# EAGLE board microBoard_power (EAGLE 6.2), part 1 of 2
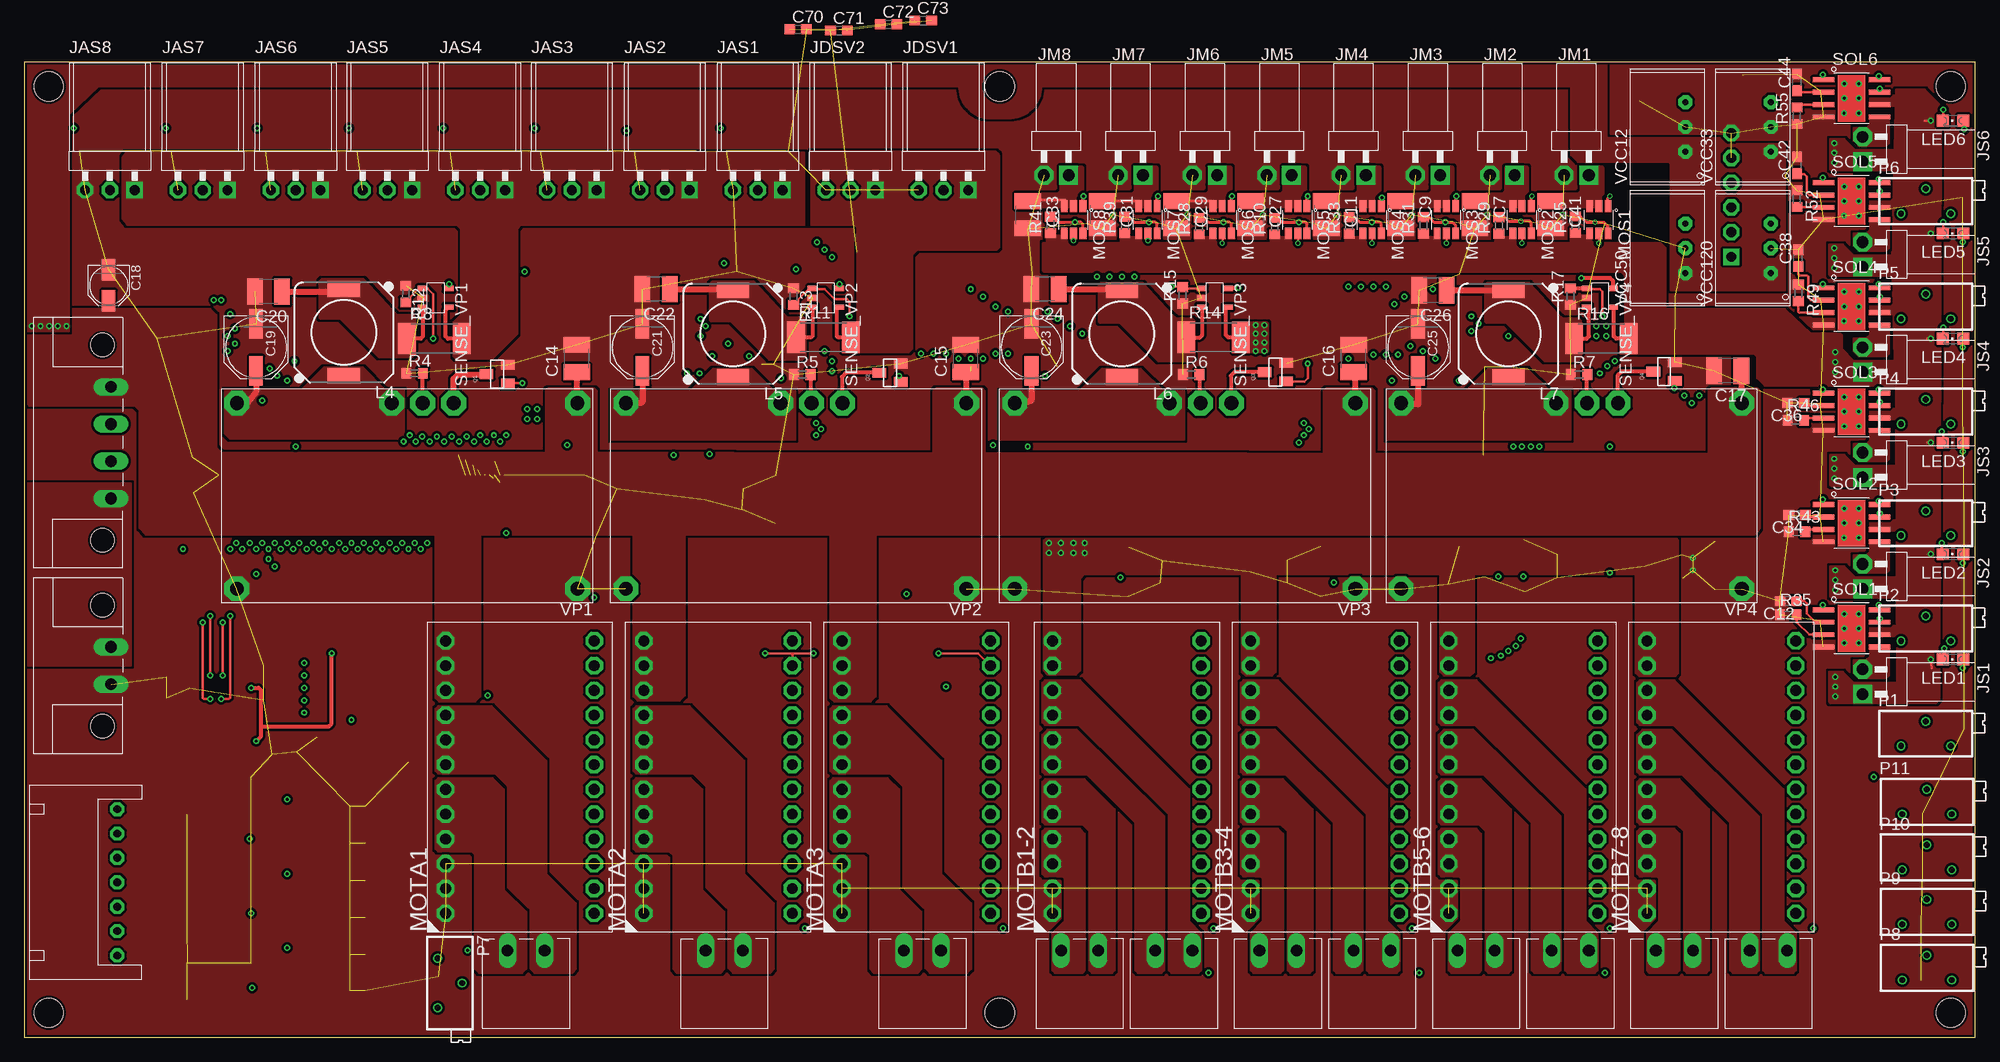
[diagram p8: board, top side]
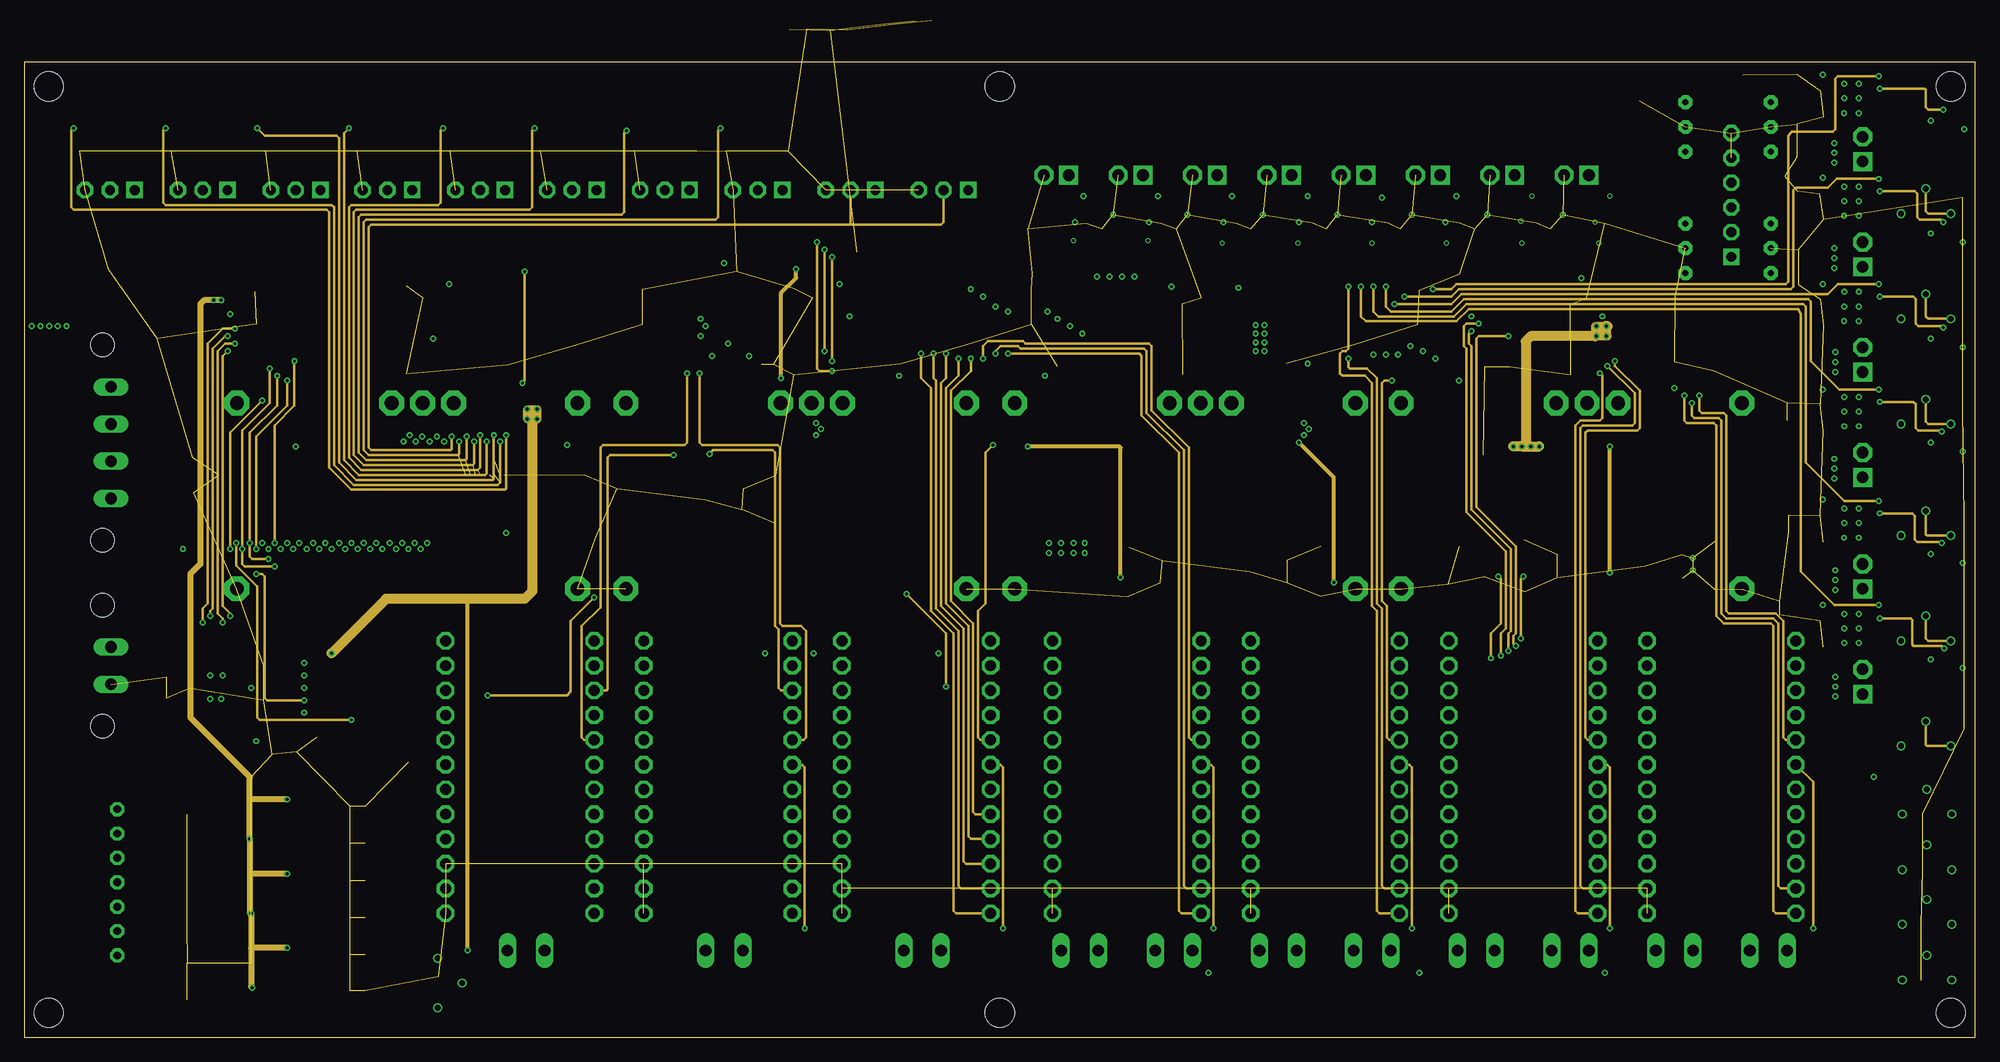
[diagram p9: board, inner layer Route2]
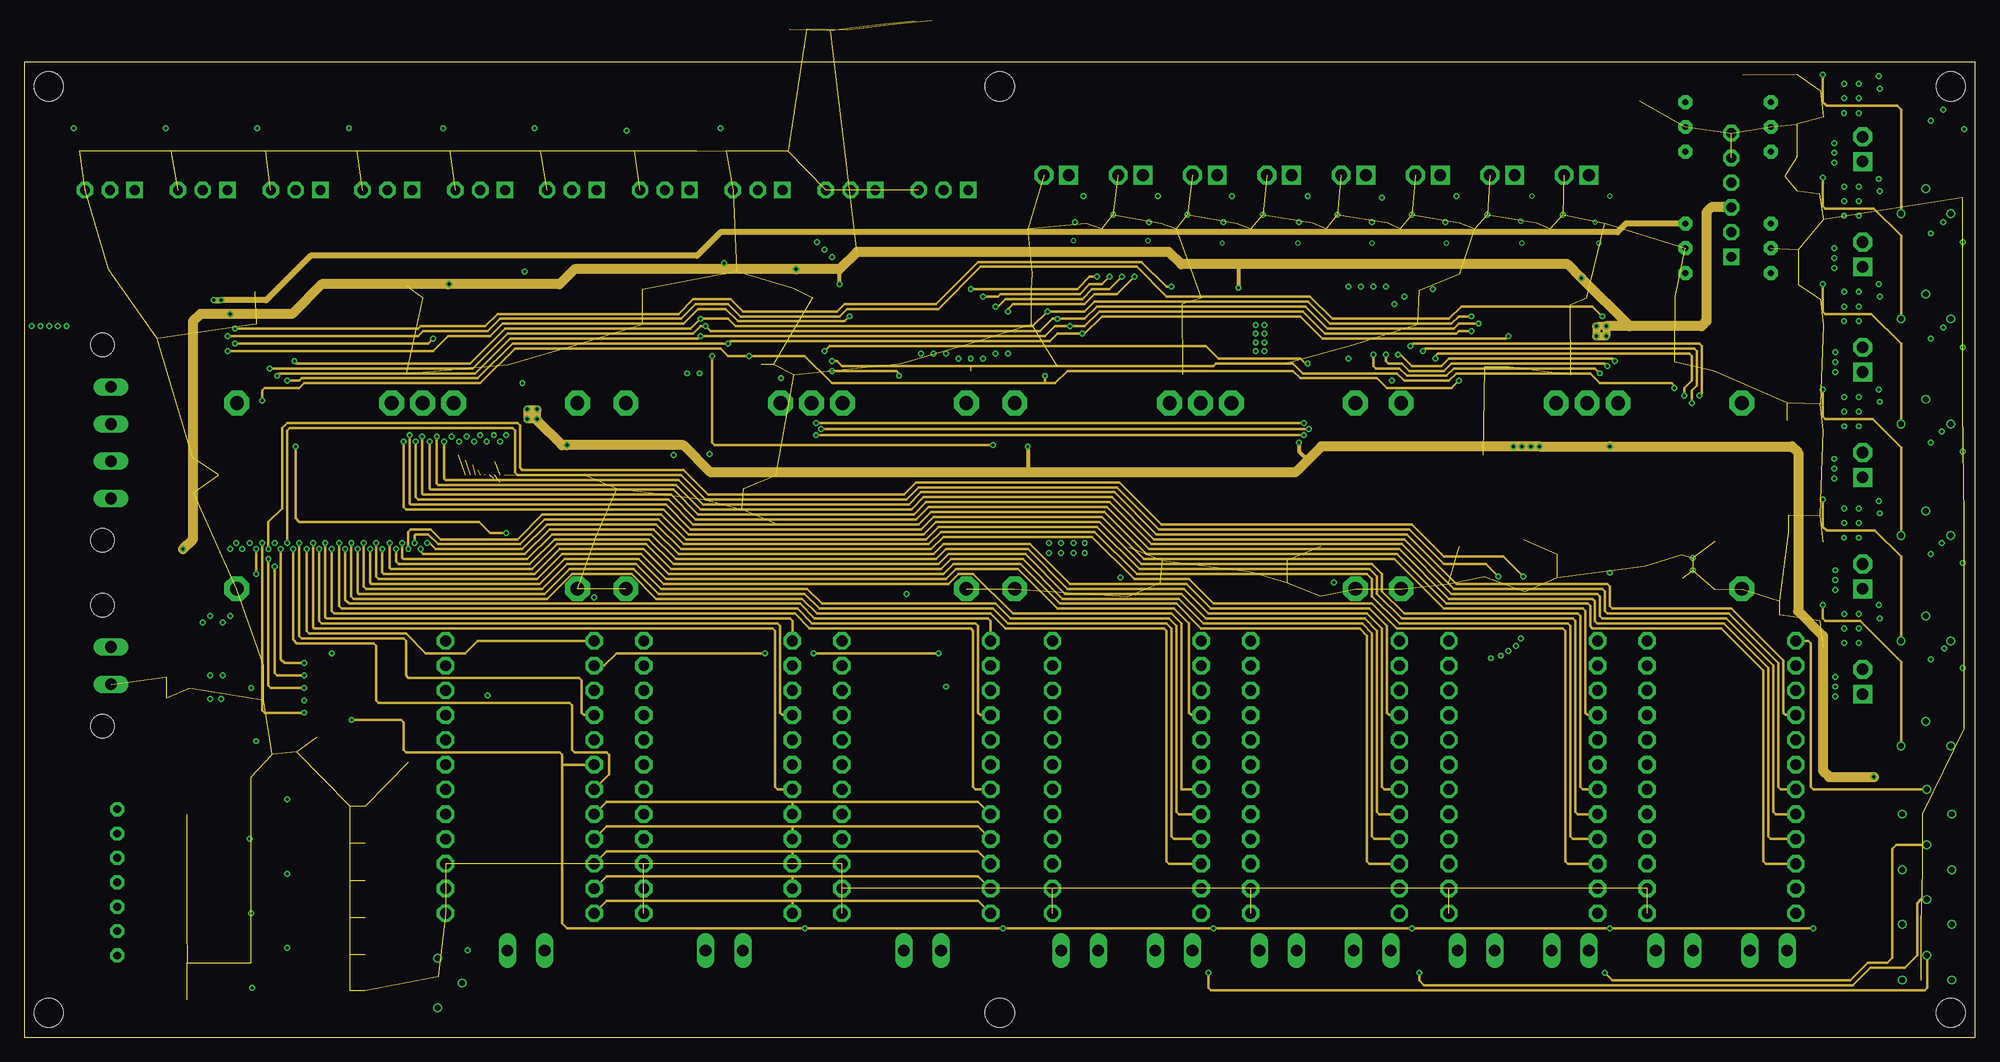
[diagram p10: board, inner layer Route15]
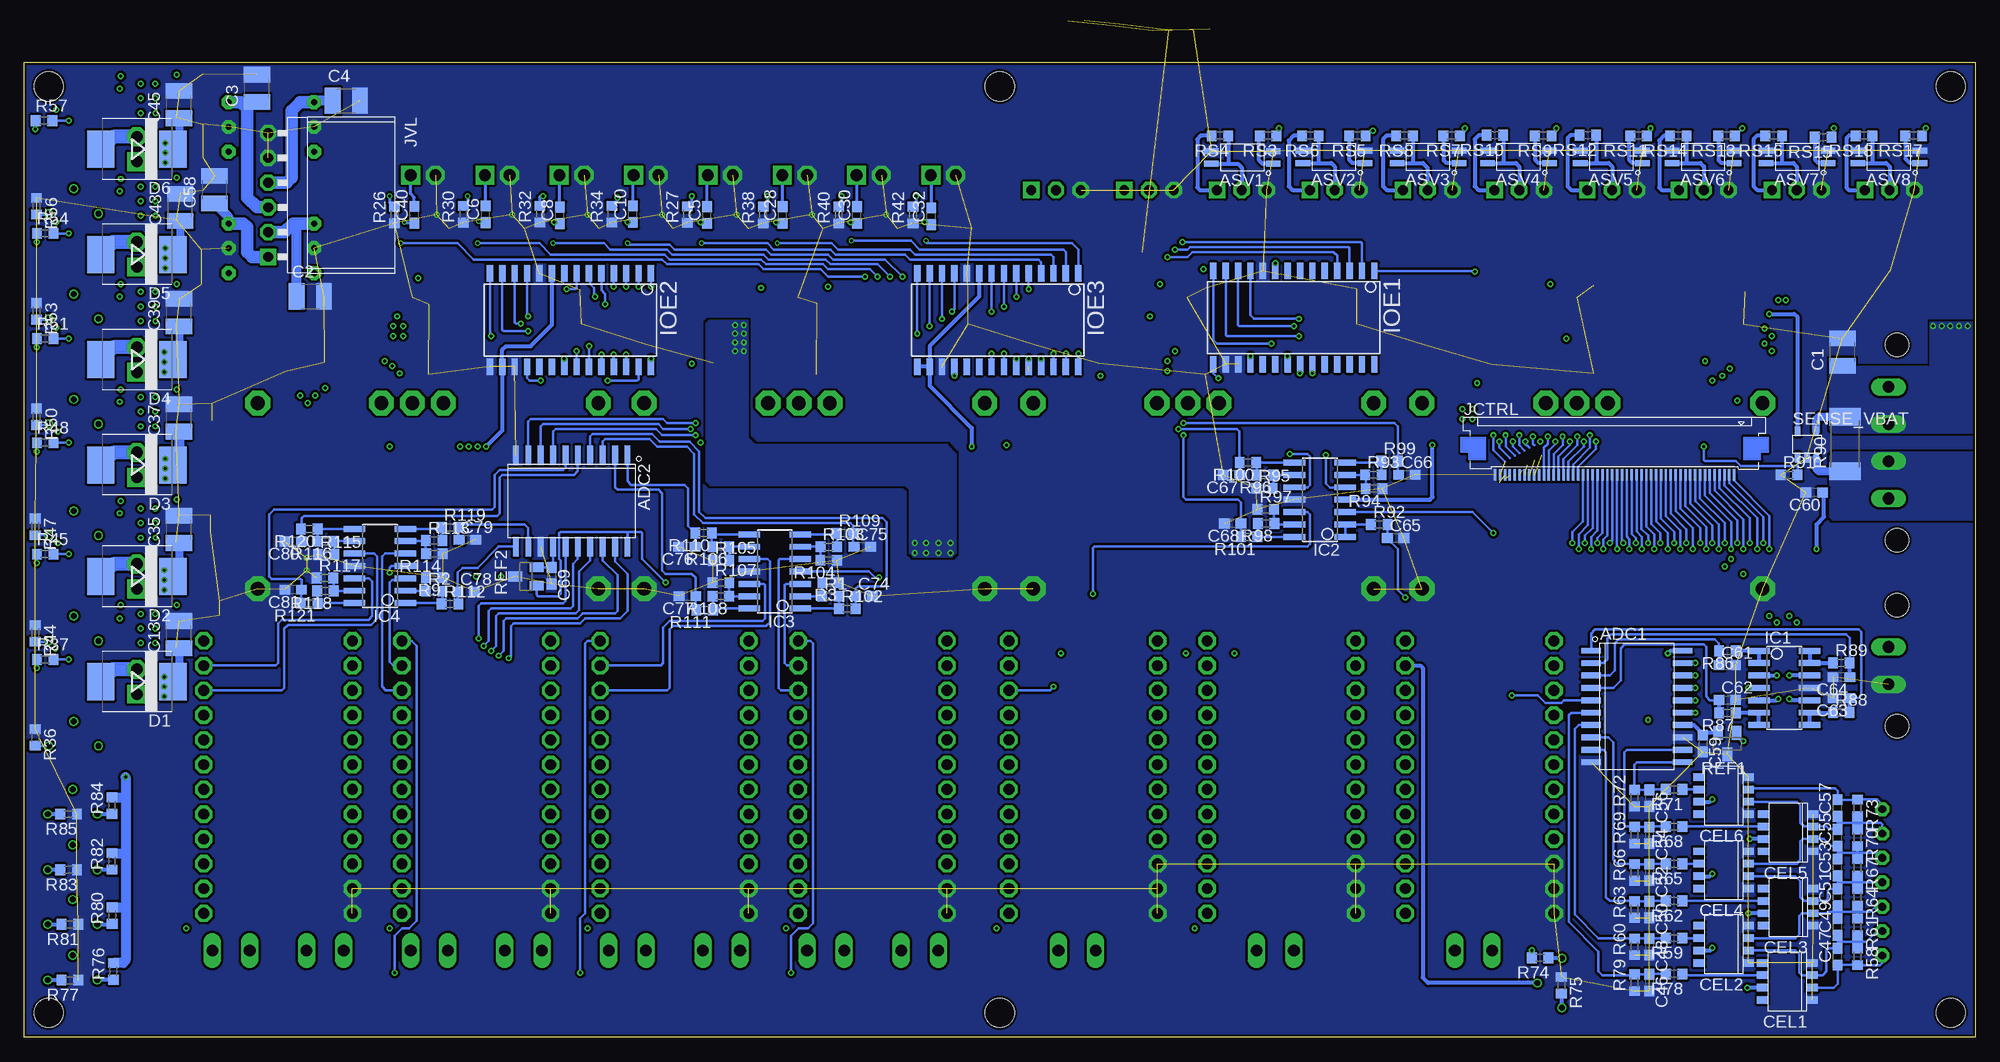
[diagram p11: board, bottom side, seen from below]

Size 200 x 100 mm. Coordinates in mm from the lower left corner, seen from the top.
Outline: 0,0 200,0 200,100 0,100 0,0
Copper layers (1*2*15*16): Top 0.035mm / dielectric 0.2mm / Route2 0.0175mm / dielectric 0.3mm / Route15 0.0175mm / dielectric 0.2mm / Bottom 0.035mm
Design rules: minimum track width 8mil, minimum drill 0.3mm, track to track 8mil, track to pad 8mil, pad to pad 8mil, via to via 8mil, smd to smd 0mil, copper to edge 10mil, drill to drill 8mil, minimum pad ring 6mil, minimum via ring 4mil, stop-mask expansion 4mil, vias tented up to drill 100mil, thermal gap 10mil
Holes 3 mm at 197.5,2.5 2.5,2.5 2.5,97.5 197.5,97.5 100,2.5 100,97.5

## Footprints (pad centres in the part's own frame; a part is rotated, then mirrored left to right if it is on the bottom)
SSOP_20 = smd 0.6 x 2: 1 -5.715,-4.7; 2 -4.445,-4.7; 3 -3.175,-4.7; 4 -1.905,-4.7; 5 -0.635,-4.7; 6 0.635,-4.7; 7 1.905,-4.7; 8 3.175,-4.7; 9 4.445,-4.7; 10 5.715,-4.7; 11 5.715,4.7; 12 4.445,4.7; 13 3.175,4.7; 14 1.905,4.7; 15 0.635,4.7; 16 -0.635,4.7; 17 -1.905,4.7; 18 -3.175,4.7; 19 -4.445,4.7; 20 -5.715,4.7
SSOP_4 = smd 1.5 x 0.6: 1 -3.175,0.635; 2 -3.175,-0.635; 3 3.175,-0.635; 4 3.175,0.635
C3225 = smd 1.6 x 2.7: 1 -1.4,0; 2 1.4,0
C1210 = smd 1.6 x 2.7: 1 -1.4,0; 2 1.4,0
C0603 = smd 1.1 x 1: 1 -0.85,0; 2 0.85,0
PANASONIC_B = smd 2.2 x 1.4: + 1.6,0; - -1.6,0
PANASONIC_D = smd 3 x 1.4: + 2.4,0; - -2.4,0
S8 = smd 0.762 x 1.143: 1 -1.905,-2.54; 2 -0.635,-2.54; 3 0.635,-2.54; 4 1.905,-2.54; 5 1.905,2.54; 6 0.635,2.54; 7 -0.635,2.54; 8 -1.905,2.54
SMC = smd 2.8 x 3.8: A 3.7,0; C -3.7,0
SO14 = smd 0.61 x 2.21: 1 -3.81,-2.603; 2 -2.54,-2.603; 3 -1.27,-2.603; 4 0,-2.603; 5 1.27,-2.603; 6 2.54,-2.603; 7 3.81,-2.603; 8 3.81,2.603; 9 2.54,2.603; 10 1.27,2.603; 11 0,2.603; 12 -1.27,2.603; 13 -2.54,2.603; 14 -3.81,2.603
SO28W = smd 0.65 x 1.7: 1 -7.62,-4.78; 2 -6.35,-4.78; 3 -5.08,-4.78; 4 -3.81,-4.78; 5 -2.54,-4.78; 6 -1.27,-4.78; 7 0,-4.78; 8 1.27,-4.78; 9 2.54,-4.78; 10 3.81,-4.78; 11 5.08,-4.78; 12 6.35,-4.78; 13 7.62,-4.78; 14 8.89,-4.78; 15 8.89,4.78; 16 7.62,4.78; 17 6.35,4.78; 18 5.08,4.78; 19 3.81,4.78; 20 2.54,4.78; 21 1.27,4.78; 22 0,4.78; 23 -1.27,4.78; 24 -2.54,4.78; 25 -3.81,4.78; 26 -5.08,4.78; 27 -6.35,4.78; 28 -7.62,4.78
JST-XH-7S = drill 0.8 pad 1.422 octagon: 1 -7.5,0; 2 -5,0; 3 -2.5,0; 4 0,0; 5 2.5,0; 6 5,0; 7 7.5,0
CON_3.81_2 = drill 1.2 long: 1 -1.905,0; 2 1.905,0
HE14_H_3 = drill 1 pad 1.676 square: 1 -2.54,0 | drill 1 pad 1.676 octagon: 2 0,0; 3 2.54,0
CON_3.81_LR_2 = drill 1.2 long: 1 -1.905,0; 2 1.905,0 | hole 2.4: -6.205,-0.9; 6.205,-0.9
FFC-SMD-0.5_50 = smd 0.25 x 1.2: 1 -12.25,0; 2 -11.75,0; 3 -11.25,0; 4 -10.75,0; 5 -10.25,0; 6 -9.75,0; 7 -9.25,0; 8 -8.75,0; 9 -8.25,0; 10 -7.75,0; 11 -7.25,0; 12 -6.75,0; 13 -6.25,0; 14 -5.75,0; 15 -5.25,0; 16 -4.75,0; 17 -4.25,0; 18 -3.75,0; 19 -3.25,0; 20 -2.75,0; 21 -2.25,0; 22 -1.75,0; 23 -1.25,0; 24 -0.75,0; 25 -0.25,0; 26 0.25,0; 27 0.75,0; 28 1.25,0; 29 1.75,0; 30 2.25,0; 31 2.75,0; 32 3.25,0; 33 3.75,0; 34 4.25,0; 35 4.75,0; 36 5.25,0; 37 5.75,0; 38 6.25,0; 39 6.75,0; 40 7.25,0; 41 7.75,0; 42 8.25,0; 43 8.75,0; 44 9.25,0; 45 9.75,0; 46 10.25,0; 47 10.75,0; 48 11.25,0; 49 11.75,0; 50 12.25,0
CON_2.54_H_2 = drill 1.2 pad 1.93 square: 1 1.27,0 | drill 1.2 pad 1.93 octagon: 2 -1.27,0
CON_3.81_LR_4 = drill 1.2 long: 1 -5.715,0; 2 -1.905,0; 3 1.905,0; 4 5.715,0 | hole 2.4: -10.015,-0.9; 10.015,-0.9
HE14_H_6 = drill 1 pad 1.676 square: 1 -6.35,0 | drill 1 pad 1.676 octagon: 2 -3.81,0; 3 -1.27,0; 4 1.27,0; 5 3.81,0; 6 6.35,0
DR1030 = smd 3.3 x 1.6: 1 0,4.45; 2 0,-4.45
CHIPLED_0805 = smd 1.2 x 1.2: A 0,-1.05; C 0,1.05
SSOT-6 = smd 0.7 x 1.2: 1 -0.95,-1.4; 2 0,-1.4; 3 0.95,-1.4; 4 0.95,1.4; 5 0,1.4; 6 -0.95,1.4
MODULE_DRV884X_REV = drill 1.1 pad 1.778 octagon: 1 -13.97,17.145; 2 -11.43,17.145; 3 -8.89,17.145; 4 -6.35,17.145; 5 -3.81,17.145; 6 -1.27,17.145; 7 1.27,17.145; 8 3.81,17.145; 9 6.35,17.145; 10 8.89,17.145; 11 11.43,17.145; 12 13.97,17.145; 13 1.27,1.905; 14 3.81,1.905; 15 6.35,1.905; 16 8.89,1.905; 17 11.43,1.905; 18 13.97,1.905; 19 -1.27,1.905; 20 -3.81,1.905; 21 -6.35,1.905; 22 -8.89,1.905; 23 -11.43,1.905; 24 -13.97,1.905
RTRIMT93XB = drill 0.61: 1 1.27,-2.54; 2 -1.27,0; 3 1.27,2.54
SOT23 = smd 1 x 1.4: 1 -0.95,-1.1; 2 0.95,-1.1; 3 0,1.1
R0603 = smd 1 x 1.1: 1 -0.85,0; 2 0.85,0
R2512 = smd 1.8 x 3.2: 1 -2.8,0; 2 2.8,0
DBV_05 = smd 0.55 x 1: 1 -0.95,-1.35; 2 0,-1.35; 3 0.95,-1.35; 4 0.95,1.35; 5 -0.95,1.35
PWP_8 = smd 0.5 x 2.2: 1 -1.905,-2.875; 2 -0.635,-2.875; 3 0.635,-2.875; 4 1.905,-2.875; 5 1.905,2.875; 6 0.635,2.875; 7 -0.635,2.875; 8 -1.905,2.875
TSR1 = drill 0.6 pad 1.422 octagon: 1 -2.54,0; 2 0,0; 3 2.54,0
PTN78020 = drill 1.4 pad 2.54 octagon: 1 -17.462,9.525; 2 -17.462,-9.525; 3 -4.763,-9.525; 4 -1.587,-9.525; 5 1.587,-9.525; 6 17.462,-9.525; 7 17.462,9.525

## Placement (x,y rotation side)
ADC1  TLV2553DW  [SSOP_20]  34.67,33.91 270 bottom
ADC2  TLV2553DW  [SSOP_20]  143.89,54.99 180 bottom
ASV1  EL3H7-G  [SSOP_4]  75.14,90.2 180 bottom
ASV2  EL3H7-G  [SSOP_4]  65.74,90.26 180 bottom
ASV3  EL3H7-G  [SSOP_4]  56.09,90.26 180 bottom
ASV4  EL3H7-G  [SSOP_4]  46.82,90.26 180 bottom
ASV5  EL3H7-G  [SSOP_4]  37.29,90.26 180 bottom
ASV6  EL3H7-G  [SSOP_4]  27.89,90.26 180 bottom
ASV7  EL3H7-G  [SSOP_4]  18.24,90.26 180 bottom
ASV8  EL3H7-G  [SSOP_4]  8.85,90.26 180 bottom
C1  22uF  [C3225]  13.6,70.24 90 bottom
C2  47uF  [C1210]  170.68,75.96 0 bottom
C3  47uF  [C1210]  176.16,97.29 90 bottom
C4  47uF  [C1210]  167,96.02 0 bottom
C5  1nF  [C0603]  130,84.3 90 bottom
C6  1nF  [C0603]  152.71,84.38 90 bottom
C7  10uF  [C1210]  148.72,84.33 270 top
C8  1nF  [C0603]  145.11,84.27 90 bottom
C9  10uF  [C1210]  141.1,84.33 270 top
C10  1nF  [C0603]  137.62,84.4 90 bottom
C11  10uF  [C1210]  133.48,84.33 270 top
C12  10nF  [C0603]  180.85,44.7 180 top
C13  1uF  [C1210]  184.15,41.27 90 bottom
C14  22uF  [C3225]  56.64,69.6 90 top
C15  22uF  [C3225]  96.52,69.6 90 top
C16  22uF  [C3225]  136.27,69.6 90 top
C17  22uF  [C3225]  174.62,68.33 180 top
C18  470uF  [PANASONIC_B]  8.64,77.09 270 top
C19  470uF  [PANASONIC_D]  23.75,70.74 270 top
C20  1uF  [C3225]  25.02,76.45 180 top
C21  470uF  [PANASONIC_D]  63.37,70.74 270 top
C22  1uF  [C3225]  64.77,76.71 180 top
C23  470uF  [PANASONIC_D]  103.25,70.74 270 top
C24  1uF  [C3225]  104.65,76.71 180 top
C25  470uF  [PANASONIC_D]  142.88,70.74 270 top
C26  1uF  [C3225]  144.4,76.58 180 top
C27  10uF  [C1210]  125.73,84.33 270 top
C28  1nF  [C0603]  122.26,84.3 90 bottom
C29  10uF  [C1210]  118.11,84.33 270 top
C30  1nF  [C0603]  114.64,84.3 90 bottom
C31  10uF  [C1210]  110.49,84.33 270 top
C32  1nF  [C0603]  107.02,84.18 90 bottom
C33  10uF  [C1210]  102.87,84.33 270 top
C34  10nF  [C0603]  181.74,53.55 180 top
C35  1uF  [C1210]  184.15,52.07 90 bottom
C36  10nF  [C0603]  181.61,65.02 180 top
C37  1uF  [C1210]  184.15,63.5 90 bottom
C38  10nF  [C0603]  181.86,79.88 90 top
C39  1uF  [C1210]  184.15,74.3 90 bottom
C40  1nF  [C0603]  160.02,84.33 90 bottom
C41  10uF  [C1210]  156.46,84.33 270 top
C42  10nF  [C0603]  181.74,89.41 90 top
C43  1uF  [C1210]  184.02,85.09 90 bottom
C44  10nF  [C0603]  181.74,97.92 90 top
C45  1uF  [C1210]  184.15,95.63 90 bottom
C46  100nF  [C0603]  33.4,5.59 270 bottom
C47  100nF  [C0603]  14.1,8.26 90 bottom
C48  100nF  [C0603]  33.4,9.27 270 bottom
C49  100nF  [C0603]  14.1,11.3 90 bottom
C50  10nF  [C0603]  33.4,13.08 270 bottom
C51  100nF  [C0603]  14.1,14.35 90 bottom
C52  10nF  [C0603]  33.4,16.89 270 bottom
C53  100nF  [C0603]  14.1,17.4 90 bottom
C54  10nF  [C0603]  33.4,20.7 270 bottom
C55  100nF  [C0603]  14.1,20.45 90 bottom
C56  10nF  [C0603]  33.4,24.51 270 bottom
C57  100nF  [C0603]  14.1,23.5 90 bottom
C58  47uF  [C1210]  180.5,86.9 90 bottom
C59  100nF  [C0603]  27.92,30.11 270 bottom
C60  220nF  [C0603]  16.5,55.86 180 bottom
C61  3.3nF  [C0603]  25.41,38.13 0 bottom
C62  3.3nF  [C0603]  25.41,34.58 0 bottom
C63  3.3nF  [C0603]  13.71,34.76 180 bottom
C64  3.3nF  [C0603]  13.71,36.92 180 bottom
C65  3.3nF  [C0603]  59.4,51.19 0 bottom
C66  3.3nF  [C0603]  58.25,57.68 0 bottom
C67  3.3nF  [C0603]  76.24,57.63 180 bottom
C68  3.3nF  [C0603]  76.11,52.68 180 bottom
C69  100nF  [C0603]  145.95,47.32 270 bottom
C70  220nF  [C0603]  79.32,103.36 0 top  (outside the outline)
C71  100nF  [C0603]  83.51,103.23 0 top  (outside the outline)
C72  100nF  [C0603]  88.59,103.87 0 top  (outside the outline)
C73  100nF  [C0603]  92.15,104.25 0 top  (outside the outline)
C74  3.3nF  [C0603]  113.92,45.21 0 bottom
C75  3.3nF  [C0603]  114.1,50.28 0 bottom
C76  3.3nF  [C0603]  132.08,50.29 180 bottom
C77  3.3nF  [C0603]  132.02,45.22 180 bottom
C78  3.3nF  [C0603]  154.71,45.69 0 bottom
C79  3.3nF  [C0603]  154.59,51.02 0 bottom
C80  3.3nF  [C0603]  172.44,50.84 180 bottom
C81  3.3nF  [C0603]  172.44,45.88 180 bottom
CEL1  LT1990  [S8]  19.25,5.71 90 bottom
CEL2  LT1990  [S8]  25.78,9.53 90 bottom
CEL3  LT1990  [S8]  19.18,13.34 90 bottom
CEL4  LT1990  [S8]  25.78,17.14 90 bottom
CEL5  LT1990  [S8]  19.18,20.95 90 bottom
CEL6  LT1990  [S8]  25.78,24.77 90 bottom
D1  MBRS340T3  [SMC]  188.47,36.45 180 bottom
D2  MBRS340T3  [SMC]  188.47,47.24 180 bottom
D3  MBRS340T3  [SMC]  188.47,58.67 180 bottom
D4  MBRS340T3  [SMC]  188.47,69.47 180 bottom
D5  MBRS340T3  [SMC]  188.47,80.26 180 bottom
D6  MBRS340T3  [SMC]  188.47,91.06 180 bottom
IC1  OPA4340U  [SO14]  19.56,35.81 270 bottom
IC2  OPA4340U  [SO14]  67.18,55.12 90 bottom
IC3  OPA4340U  [SO14]  123.06,47.75 90 bottom
IC4  OPA4340U  [SO14]  163.54,48.32 90 bottom
IOE1  MCP23S17SO  [SO28W]  69.22,73.79 180 bottom
IOE2  MCP23S17SO  [SO28W]  143.38,73.53 180 bottom
IOE3  MCP23S17SO  [SO28W]  99.57,73.53 180 bottom
J1  JST-XH-S_7  [JST-XH-7S]  9.53,15.88 90 top
JA1  MC15-G-3-3.81_2  [CON_3.81_2]  51.44,8.89 0 top
JA2  MC15-G-3-3.81_2  [CON_3.81_2]  71.75,8.89 0 top
JA3  MC15-G-3-3.81_2  [CON_3.81_2]  92.08,8.89 0 top
JAS1  HE14_H_3  [HE14_H_3]  75.18,86.87 180 top
JAS2  HE14_H_3  [HE14_H_3]  65.66,86.87 180 top
JAS3  HE14_H_3  [HE14_H_3]  56.13,86.87 180 top
JAS4  HE14_H_3  [HE14_H_3]  46.74,86.87 180 top
JAS5  HE14_H_3  [HE14_H_3]  37.21,86.87 180 top
JAS6  HE14_H_3  [HE14_H_3]  27.81,86.87 180 top
JAS7  HE14_H_3  [HE14_H_3]  18.29,86.87 180 top
JAS8  HE14_H_3  [HE14_H_3]  8.76,86.87 180 top
JB1  MC15-G-3-3.81_2  [CON_3.81_2]  108.2,8.89 0 top
JB2  MC15-G-3-3.81_2  [CON_3.81_2]  117.86,8.89 0 top
JB3  MC15-G-3-3.81_2  [CON_3.81_2]  128.52,8.89 0 top
JB4  MC15-G-3-3.81_2  [CON_3.81_2]  138.18,8.89 0 top
JB5  MC15-G-3-3.81_2  [CON_3.81_2]  148.84,8.89 0 top
JB6  MC15-G-3-3.81_2  [CON_3.81_2]  158.5,8.89 0 top
JB7  MC15-G-3-3.81_2  [CON_3.81_2]  169.16,8.89 0 top
JB8  MC15-G-3-3.81_2  [CON_3.81_2]  178.82,8.89 0 top
JBAT1  MC15-GF-3.81-LR_2  [CON_3.81_LR_2]  8.89,38.1 270 top
JCTRL  FFC-0.5_50  [FFC-SMD-0.5_50]  36.96,57.66 180 bottom
JDSV1  HE14_H_3  [HE14_H_3]  94.23,86.87 180 top
JDSV2  HE14_H_3  [HE14_H_3]  84.71,86.87 180 top
JM1  CON_2.54_H_2  [CON_2.54_H_2]  159.13,88.39 0 top
JM2  CON_2.54_H_2  [CON_2.54_H_2]  151.51,88.39 0 top
JM3  CON_2.54_H_2  [CON_2.54_H_2]  143.89,88.39 0 top
JM4  CON_2.54_H_2  [CON_2.54_H_2]  136.27,88.39 0 top
JM5  CON_2.54_H_2  [CON_2.54_H_2]  128.65,88.39 0 top
JM6  CON_2.54_H_2  [CON_2.54_H_2]  121.03,88.39 0 top
JM7  CON_2.54_H_2  [CON_2.54_H_2]  113.41,88.39 0 top
JM8  CON_2.54_H_2  [CON_2.54_H_2]  105.79,88.39 0 top
JS1  CON_2.54_H_2  [CON_2.54_H_2]  188.47,36.45 270 top
JS2  CON_2.54_H_2  [CON_2.54_H_2]  188.47,47.24 270 top
JS3  CON_2.54_H_2  [CON_2.54_H_2]  188.47,58.67 270 top
JS4  CON_2.54_H_2  [CON_2.54_H_2]  188.47,69.47 270 top
JS5  CON_2.54_H_2  [CON_2.54_H_2]  188.47,80.26 270 top
JS6  CON_2.54_H_2  [CON_2.54_H_2]  188.47,91.06 270 top
JSW  MC15-GF-3.81-LR_4  [CON_3.81_LR_4]  8.89,60.96 270 top
JVL  HE14_H_6  [HE14_H_6]  175.01,86.36 90 bottom
L4  [DR1030]  32.77,72.26 180 top
L5  [DR1030]  72.64,72.14 180 top
L6  [DR1030]  112.52,72.14 180 top
L7  [DR1030]  152.15,72.14 180 top
LED1  [CHIPLED_0805]  197.74,38.73 90 top
LED2  [CHIPLED_0805]  197.74,49.53 90 top
LED3  [CHIPLED_0805]  197.74,60.96 90 top
LED4  [CHIPLED_0805]  197.74,71.63 90 top
LED5  [CHIPLED_0805]  197.74,82.42 90 top
LED6  [CHIPLED_0805]  197.74,93.98 90 top
MOS1  FDC6330L  [SSOT-6]  161.42,83.82 180 top
MOS2  FDC6330L  [SSOT-6]  153.54,83.82 180 top
MOS3  FDC6330L  [SSOT-6]  145.8,83.82 180 top
MOS4  FDC6330L  [SSOT-6]  138.18,83.82 180 top
MOS5  FDC6330L  [SSOT-6]  130.56,83.82 180 top
MOS6  FDC6330L  [SSOT-6]  122.81,83.82 180 top
MOS7  FDC6330L  [SSOT-6]  115.19,83.82 180 top
MOS8  FDC6330L  [SSOT-6]  107.57,83.82 180 top
MOTA1  MODULE_DRV8842REV  [MODULE_DRV884X_REV]  60.33,26.67 90 top
MOTA2  MODULE_DRV8842REV  [MODULE_DRV884X_REV]  80.64,26.67 90 top
MOTA3  MODULE_DRV8842REV  [MODULE_DRV884X_REV]  100.97,26.67 90 top
MOTB1-2  MODULE_DRV8843REV  [MODULE_DRV884X_REV]  122.56,26.67 90 top
MOTB3-4  MODULE_DRV8843REV  [MODULE_DRV884X_REV]  142.88,26.67 90 top
MOTB5-6  MODULE_DRV8843REV  [MODULE_DRV884X_REV]  163.19,26.67 90 top
MOTB7-8  MODULE_DRV8843REV  [MODULE_DRV884X_REV]  183.51,26.67 90 top
P1  33k  [RTRIMT93XB]  194.94,31.11 270 top
P2  33k  [RTRIMT93XB]  194.94,41.91 270 top
P3  33k  [RTRIMT93XB]  194.94,52.7 270 top
P4  33k  [RTRIMT93XB]  194.94,64.14 270 top
P5  33k  [RTRIMT93XB]  194.94,74.93 270 top
P6  33k  [RTRIMT93XB]  194.94,85.72 270 top
P7  47k  [RTRIMT93XB]  43.63,5.55 180 top
P8  47k  [RTRIMT93XB]  195.06,7.12 270 top
P9  47k  [RTRIMT93XB]  195.06,12.84 270 top
P10  47k  [RTRIMT93XB]  195.06,18.43 270 top
P11  47k  [RTRIMT93XB]  195.06,24.14 270 top
Q1  BSS138  [SOT23]  48.48,68 90 top
Q2  BSS138  [SOT23]  88.73,68.13 90 top
Q3  BSS138  [SOT23]  128.27,68.2 90 top
Q4  BSS138  [SOT23]  168.11,68.26 90 top
R1  33k  [R0603]  117.35,45.21 0 bottom
R2  33k  [R0603]  157.99,45.72 0 bottom
R3  10k  [R0603]  117.35,46.61 180 bottom
R4  21k  [R0603]  40.01,68.07 0 top
R5  3.3k  [R0603]  79.76,67.94 0 top
R6  383k  [R0603]  119.63,67.94 0 top
R7  383k  [R0603]  159.38,67.94 0 top
R8  R005  [R2512]  42.04,71.63 0 top
R9  10k  [R0603]  157.99,47.12 180 bottom
R10  47k  [R0603]  128.19,83.16 90 top
R11  R005  [R2512]  81.92,71.75 0 top
R12  500k  [R0603]  39.12,76.2 270 top
R13  500k  [R0603]  78.87,75.95 270 top
R14  R005  [R2512]  121.92,71.75 0 top
R15  500k  [R0603]  118.75,76.07 90 top
R16  R005  [R2512]  161.67,71.63 0 top
R17  500k  [R0603]  158.5,75.95 90 top
R25  47k  [R0603]  159,83.31 90 top
R26  1k  [R0603]  162.05,84.33 90 bottom
R27  1k  [R0603]  132.03,84.35 90 bottom
R28  47k  [R0603]  120.44,83.16 90 top
R29  47k  [R0603]  151.18,83.24 90 top
R30  1k  [R0603]  154.99,84.38 90 bottom
R31  47k  [R0603]  143.44,83.24 90 top
R32  1k  [R0603]  147.14,84.4 90 bottom
R33  47k  [R0603]  135.82,83.24 90 top
R34  1k  [R0603]  139.77,84.4 90 bottom
R35  100k  [R0603]  180.85,43.31 0 top
R36  16.9k  [R0603]  198.88,30.73 270 bottom
R37  5k  [R0603]  197.87,38.73 0 bottom
R38  1k  [R0603]  124.25,84.3 90 bottom
R39  47k  [R0603]  112.82,83.29 90 top
R40  1k  [R0603]  116.5,84.3 90 bottom
R41  47k  [R0603]  105.2,83.29 90 top
R42  1k  [R0603]  108.88,84.3 90 bottom
R43  100k  [R0603]  181.74,51.82 0 top
R44  16.9k  [R0603]  198.88,41.4 270 bottom
R45  5k  [R0603]  197.87,49.53 0 bottom
R46  100k  [R0603]  181.61,63.25 0 top
R47  16.9k  [R0603]  198.88,52.32 270 bottom
R48  5k  [R0603]  197.87,60.96 0 bottom
R49  100k  [R0603]  181.86,76.33 270 top
R50  16.9k  [R0603]  198.75,63.61 270 bottom
R51  5k  [R0603]  197.87,71.63 0 bottom
R52  100k  [R0603]  181.74,85.98 270 top
R53  16.9k  [R0603]  198.75,74.42 270 bottom
R54  5k  [R0603]  197.87,82.42 0 bottom
R55  100k  [R0603]  181.74,94.49 90 top
R56  16.9k  [R0603]  198.75,85.22 270 bottom
R57  5k  [R0603]  197.99,93.98 0 bottom
R58  50k  [R0603]  12.06,8.26 270 bottom
R59  3.9k  [R0603]  30.86,10.16 180 bottom
R60  10k  [R0603]  34.92,9.27 90 bottom
R61  50k  [R0603]  12.06,11.3 270 bottom
R62  3.9k  [R0603]  30.86,13.97 180 bottom
R63  10k  [R0603]  34.92,13.08 90 bottom
R64  50k  [R0603]  12.06,14.35 270 bottom
R65  3.9k  [R0603]  30.86,17.78 180 bottom
R66  10k  [R0603]  34.92,16.89 90 bottom
R67  50k  [R0603]  12.06,17.4 270 bottom
R68  3.9k  [R0603]  30.86,21.59 180 bottom
R69  10k  [R0603]  34.92,20.7 90 bottom
R70  50k  [R0603]  12.06,20.45 270 bottom
R71  3.9k  [R0603]  30.86,25.4 180 bottom
R72  10k  [R0603]  34.92,24.51 90 bottom
R73  50k  [R0603]  12.06,23.5 270 bottom
R74  33k  [R0603]  44.59,8.14 180 bottom
R75  22k  [R0603]  42.43,5.32 270 bottom
R76  33k  [R0603]  190.87,6.74 90 bottom
R77  22k  [R0603]  195.34,5.85 180 bottom
R78  2.7k  [R0603]  30.86,6.48 180 bottom
R79  10k  [R0603]  34.92,5.59 90 bottom
R80  33k  [R0603]  191,12.46 90 bottom
R81  22k  [R0603]  195.34,11.57 180 bottom
R82  33k  [R0603]  191.02,18.02 90 bottom
R83  22k  [R0603]  195.47,17.16 180 bottom
R84  33k  [R0603]  191.02,23.74 90 bottom
R85  22k  [R0603]  195.47,22.87 180 bottom
R86  500  [R0603]  25.39,39.6 180 bottom
R87  500  [R0603]  25.39,33.25 180 bottom
R88  500  [R0603]  13.72,33.3 0 bottom
R89  500  [R0603]  13.72,38.38 0 bottom
R90  R005  [R2512]  13.34,60.83 90 bottom
R91  300k  [R0603]  19.08,57.66 0 bottom
R92  500  [R0603]  61.09,52.58 0 bottom
R93  33k  [R0603]  61.69,57.67 0 bottom
R94  10k  [R0603]  61.63,56.24 180 bottom
R95  10k  [R0603]  72.87,56.28 0 bottom
R96  33k  [R0603]  72.8,57.64 180 bottom
R97  10k  [R0603]  72.74,54.12 0 bottom
R98  33k  [R0603]  72.68,52.68 180 bottom
R99  500  [R0603]  60.03,59.08 0 bottom
R100  500  [R0603]  74.55,58.93 180 bottom
R101  500  [R0603]  74.42,51.31 180 bottom
R102  500  [R0603]  115.62,43.93 0 bottom
R103  33k  [R0603]  117.53,50.28 0 bottom
R104  10k  [R0603]  117.54,48.9 180 bottom
R105  10k  [R0603]  128.58,48.89 0 bottom
R106  33k  [R0603]  128.59,50.3 180 bottom
R107  10k  [R0603]  128.58,46.6 0 bottom
R108  33k  [R0603]  128.6,45.22 180 bottom
R109  500  [R0603]  115.88,51.68 0 bottom
R110  500  [R0603]  130.37,51.69 180 bottom
R111  500  [R0603]  130.25,43.82 180 bottom
R112  500  [R0603]  156.36,44.41 0 bottom
R113  33k  [R0603]  157.99,50.93 0 bottom
R114  10k  [R0603]  157.96,49.57 180 bottom
R115  10k  [R0603]  169.06,49.49 0 bottom
R116  33k  [R0603]  169.14,50.84 180 bottom
R117  10k  [R0603]  169.19,47.08 0 bottom
R118  33k  [R0603]  169.14,45.76 180 bottom
R119  500  [R0603]  156.37,52.28 0 bottom
R120  500  [R0603]  170.79,52.11 180 bottom
R121  500  [R0603]  170.79,44.49 180 bottom
REF1  REF3030  [SOT23]  25.4,30.1 180 bottom
REF2  REF3030  [SOT23]  148.59,47.24 90 bottom
RS3  330  [R0603]  72.47,92.42 180 bottom
RS4  330  [R0603]  77.42,92.42 180 bottom
RS5  330  [R0603]  63.33,92.42 180 bottom
RS6  330  [R0603]  68.15,92.42 180 bottom
RS7  330  [R0603]  53.68,92.42 180 bottom
RS8  330  [R0603]  58.5,92.42 180 bottom
RS9  330  [R0603]  44.28,92.42 180 bottom
RS10  330  [R0603]  49.23,92.49 180 bottom
RS11  330  [R0603]  34.5,92.42 180 bottom
RS12  330  [R0603]  39.71,92.49 180 bottom
RS13  330  [R0603]  25.48,92.42 180 bottom
RS14  330  [R0603]  30.43,92.42 180 bottom
RS15  330  [R0603]  15.58,92.3 180 bottom
RS16  330  [R0603]  20.66,92.42 180 bottom
RS17  330  [R0603]  6.3,92.42 180 bottom
RS18  330  [R0603]  11.38,92.42 180 bottom
SENSE_VBAT  INA138  [DBV_05]  17.24,60.79 0 bottom
SENSE_VP1  INA138  [DBV_05]  42.16,75.82 270 top
SENSE_VP2  INA138  [DBV_05]  82.17,75.82 270 top
SENSE_VP3  INA138  [DBV_05]  122.05,75.82 270 top
SENSE_VP4  INA138  [DBV_05]  161.54,75.82 270 top
SOL1  DRV103  [PWP_8]  187.32,41.91 270 top
SOL2  DRV103  [PWP_8]  187.32,52.7 270 top
SOL3  DRV103  [PWP_8]  187.32,64.14 270 top
SOL4  DRV103  [PWP_8]  187.32,74.93 270 top
SOL5  DRV103  [PWP_8]  187.32,85.72 270 top
SOL6  DRV103  [PWP_8]  187.32,96.27 270 top
VCC12  TSR_1-2412  [TSR1]  170.31,93.34 90 top
VCC33  TSR_1-2433  [TSR1]  179.07,93.34 90 top
VCC50  TSR_1-2450  [TSR1]  170.31,80.9 90 top
VCC120  TSR_1-24120  [TSR1]  179.07,80.9 90 top
VP1  PTN78020W  [PTN78020]  39.24,55.5 180 top
VP2  PTN78020W  [PTN78020]  79.12,55.5 180 top
VP3  PTN78020H  [PTN78020]  119,55.5 180 top
VP4  PTN78020H  [PTN78020]  158.62,55.5 180 top

## Tracks (layer width: path | path; a pad name or v marks a point on that pad's centre or on a via)
!INHIBIT!_VP1
  Top 0.61: VP1.3 44.01,67.5 44.45,67.94 46.81,67.94 Q1.3
!INHIBIT!_VP5
  Top 0.406: Q2.3 84.26,68.13 83.82,67.69 83.82,65.09 VP2.3
!INHIBIT!_VP6
  Top 0.406: Q3.3 124.08,68.2 123.7,67.82 123.7,65.09 VP3.3
!INHIBIT!_VP7
  Top 0.406: Q4.3 163.76,68.26 163.32,67.82 163.32,65.09 VP4.3
+1V2L
  Bottom 1.016: C4.1 170.17,96.02 VCC12.3
  Bottom 1.27: VCC12.3 171.7,95.89 172.59,95 172.59,88.14 173.1,87.63 JVL.4
+3V3L  (via drill 0.3 pad 0.61)  (4 unrouted)
  Top 0.406: v23.24,35.81 24,35.81 24.26,35.56 24.26,31.88 | v23.75,30.35 24.26,30.86 24.26,31.88 | 24.26,31.88 31.24,31.88 31.5,32.13 v31.5,39.37 | SENSE_VP4.5 162.89,77.52 162.56,77.85 v159.64,77.85 | v124.46,76.83 123.44,76.83 123.4,76.79 SENSE_VP3.5 | SENSE_VP2.5 83.52,77.17 v83.57,77.22 | SENSE_VP1.5 43.51,76.75 v43.56,77.22
  Route2 0.406: v162.56,47.62 v162.56,60.58 | v134.24,46.61 134.24,57.4 v130.68,60.96 | v112.39,47.12 112.39,60.45 112.27,60.58 v102.87,60.58 | v77.6,67.56 77.6,76.33 79.12,77.85 v79.12,78.74 | v45.47,8.89 45.47,44.96
  Route2 0.813: 162.05,72.9 v161.16,72.9 161.04,72.9 161.04,71.88 162.31,71.88 162.31,72.9 | v51.56,64.39 v52.58,64.39 v52.58,63.37 v51.56,63.37 v51.56,64.39 | v51.56,64.39 51.56,64.26 52.07,63.75
  Route2 1.016: 162.31,72.9 162.05,72.9 161.04,71.88 154.43,71.88 153.92,71.37 153.92,60.96 v153.54,60.58 | v153.54,60.58 v152.65,60.58 | v153.54,60.58 v154.43,60.58 v155.32,60.58 | 52.07,63.75 52.07,45.72 51.31,44.96 45.47,44.96 37.08,44.96 v31.5,39.37
  Route15 0.406: v102.87,60.58 102.87,57.91 | v130.68,60.96 130.68,60.07 131.57,59.18 | 124.46,79.25 v124.46,76.83 | v83.57,77.22 83.57,78.61 83.44,78.74 | v71.75,79.38 71.75,78.74 | v43.56,77.22 43.56,77.09 43.43,77.22
  Route15 0.813: 161.29,72.9 v162.18,72.9 v162.18,71.88 v161.16,71.88 v161.16,72.9 | v51.56,64.39 52.07,63.88 52.07,63.75 52.2,63.75 v52.58,63.37 | v51.56,64.39 v52.58,64.39 | v51.56,64.39 v51.56,63.37 52.45,63.37 52.58,63.25 52.58,64.26
  Route15 1.016: JVL.3 172.97,85.09 172.47,84.58 172.47,73.41 171.96,72.9 164.59,72.9 | 164.59,72.9 v159.64,77.85 158.24,79.25 124.46,79.25 118.62,79.25 117.35,80.52 85.34,80.52 83.57,78.74 83.44,78.74 v79.12,78.74 71.75,78.74 56.39,78.74 54.86,77.22 43.43,77.22 30.48,77.22 27.43,74.17 v21.08,74.17 18.03,74.17 17.27,73.41 17.27,51.05 v16.26,50.04 | 164.59,72.9 v162.18,72.9 | 52.07,63.75 52.58,63.25 55.12,60.71 v55.63,60.71 67.56,60.71 70.36,57.91 102.87,57.91 130.3,57.91 131.57,59.18 132.97,60.58 v155.32,60.58 v162.56,60.58 181.23,60.58 181.86,59.94 181.86,43.69 184.4,41.15 184.4,27.3 185.04,26.67 v189.61,26.67
  Bottom 0.254: IC4.4 162.38,48.32 162.56,48.13 v162.56,47.62 | REF2.1 147.49,45.38 147.32,45.21 145.29,45.21 145.03,45.47 145.03,48.9 145.16,49.02 145.16,51.69 145.03,51.82 138.18,51.82 | ADC2.20 138.18,51.82 | 138.18,51.82 136.78,51.82 136.65,51.69 136.65,49.02 v134.24,46.61 | IC3.4 113.41,47.75 112.78,47.12 v112.39,47.12 | IOE1.15 78.11,68.07 v77.6,67.56
  Bottom 0.305: 15.49,55.7 C60.1
  Bottom 0.406: IC1.4 v23.24,35.81 | REF1.1 24.45,31.05 v23.75,30.35 | ADC1.20 31.24,39.62 v31.5,39.37 | v21.08,74.17 18.54,74.17 18.19,73.82 SENSE_VBAT.5 | v16.26,50.04 16.26,52.58 15.49,53.34 15.49,55.7 | IC2.4 55.88,55.12 55.63,55.37 v55.63,60.71 | IOE3.16 IOE3.15 | IOE3.16 107.19,66.8 102.87,62.48 v102.87,60.58 | IOE3.9 102.11,75.95 107.19,70.87 IOE3.16 | IOE2.9 145.92,73.03 148.08,70.87 150.62,70.87 151,70.48 IOE2.16 151,62.23 v152.65,60.58 | IOE1.9 v71.75,79.38 | R74.2 45.44,8.86 v45.47,8.89
  Bottom 1.016: C3.1 176.52,95.89 177.16,95.25 | v189.61,26.67 189.61,24.64 | 189.61,24.64 189.61,18.8 | 189.61,18.8 189.61,13.34 | 189.61,13.34 189.61,7.87 189.87,7.62 190.84,7.62 R76.2 | R80.2 189.64,13.31 189.61,13.34 | R82.2 189.69,18.87 189.61,18.8 | R84.2 189.66,24.59 189.61,24.64
  Bottom 1.27: JVL.3 176.15,85.09 177.16,86.11 177.16,95.25 177.8,95.89 VCC33.3
+5VL  (via drill 0.3 pad 0.61)
  Route2 0.61: v20.19,75.56 v19.43,75.56 18.41,75.56 18.03,75.18 18.03,48.51 17.02,47.5 17.02,32.77 23.11,26.67 23.11,24.38 | 23.11,24.38 v23.11,20.32 23.11,16.76 | 23.11,16.76 23.11,12.7 v23.24,12.7 23.24,9.14 | 23.24,9.14 23.24,5.21 v23.37,5.08 | v26.92,16.76 23.11,16.76 | v26.92,9.14 23.24,9.14 | v26.92,24.38 23.11,24.38
  Route15 0.61: VCC50.3 164.21,83.44 163.32,82.55 71.37,82.55 68.96,80.14 29.34,80.14 24.77,75.56 v20.19,75.56 v19.43,75.56
  Bottom 0.406: CEL2.7 27.18,8.89 v26.92,9.14 | CEL4.7 27.18,16.51 v26.92,16.76 | CEL6.7 27.18,24.13 v26.92,24.38 | CEL5.7 v23.11,20.32 | CEL3.7 v23.24,12.7 | CEL1.7 v23.37,5.08
  Bottom 1.016: C2.1 172.08,83.31 172.21,83.44
  Bottom 1.27: JVL.2 173.35,82.55 172.47,83.44 172.21,83.44 VCC50.3
+12VL
  Bottom 1.016: VCC120.3 179.07,84.08 C58.1
  Bottom 1.27: JVL.1 176.66,80.01 177.16,80.52 177.16,83.06 177.55,83.44 VCC120.3
+VBATL  (via drill 0.3 pad 0.61)
  Bottom 0.813: SENSE_VBAT.4 16.29,63.34 16,63.63 R90.2
  other vias: 0.76,72.9 1.65,72.9 2.54,72.9 3.43,72.9 4.32,72.9
  pour Bottom (isolate 0.254, rank 2, no thermals): 14.48,61.98 0,61.98 0,68.71 14.48,68.71 14.86,68.33 14.86,62.36
  pour Top (isolate 0.254, rank 2, no thermals): 168.78,76.58 180.47,76.58 180.47,91.57 174.62,91.57 174.12,92.2 162.31,92.2 162.18,92.33 162.18,94.36 158.62,94.36 158.62,90.42 159.26,89.79 168.53,89.79 168.78,89.53
  pour Top (isolate 0.254, no thermals): 0,72.39 0,100.08 162.18,100.08 162.18,93.22 158.62,93.22 158.62,97.54 104.27,97.54 arc-90 100.84,94.23 98.93,94.23 arc-90 95.89,97.54 7.62,97.54 4.57,94.61 4.57,72.39
  pour Bottom (isolate 0.254, no thermals): 0,68.45 4.57,68.45 4.57,73.28 0,73.28
+VBATP
  Top 0.61: C14.1 56.64,65.09 VP1.2 | VP2.2 96.58,68.13 C15.1 | VP3.2 136.46,68 C16.1 | VP4.2 176.09,68 C17.1
  pour Top (isolate 0.254, rank 3, no thermals): 0.51,74.68 19.05,74.68 19.68,74.04 19.68,60.45 20.19,59.94 177.93,59.82 177.93,52.2 177.42,51.56 12.45,51.56 11.81,52.2 11.81,64.26 11.3,64.77 0.51,64.77 0.25,65.02 0.13,74.3
  pour Top (isolate 0.254, rank 2, no thermals): 42.16,51.69 42.16,34.8 42.55,34.42 46.23,34.42 46.74,34.92 46.74,51.69
  pour Top (isolate 0.254, rank 2, no thermals): 62.48,51.82 62.48,34.92 62.87,34.54 67.18,34.54 67.69,35.05 67.69,51.82
  pour Top (isolate 0.254, rank 2, no thermals): 82.68,51.69 82.68,34.8 83.06,34.42 86.74,34.42 87.25,34.92 87.25,51.69
  pour Top (isolate 0.254, rank 3, no thermals): 53.47,59.82 53.47,66.29 53.72,66.55 58.42,66.55 58.67,66.29 58.67,59.82
  pour Top (isolate 0.254, rank 3, no thermals): 93.22,59.82 93.22,66.29 93.47,66.55 98.17,66.55 98.42,66.29 98.42,59.82
  pour Top (isolate 0.254, rank 3, no thermals): 133.22,59.82 133.22,66.29 133.48,66.55 138.18,66.55 138.43,66.29 138.43,59.82
  pour Top (isolate 0.254, rank 3, no thermals): 172.72,59.82 172.72,66.29 172.97,66.55 177.67,66.55 177.93,66.29 177.93,59.82
+VP1
  Top 0.406: R8.2 43.43,71.63 43.18,71.88 43.18,74.53 SENSE_VP1.4
  Bottom 0.406: RS4.2 79.41,92.42 79.76,92.08 79.76,87.12 79.5,86.87 JAS1.1 | RS18.2 12.99,92.42 13.21,92.2 13.21,87.12 12.95,86.87 JAS8.1 | RS16.2 22.39,92.42 22.73,92.08 22.73,87.25 22.35,86.87 JAS7.1 | RS14.2 31.91,92.42 32.38,91.95 32.38,87.12 32.13,86.87 JAS6.1 | RS12.2 41.49,92.49 41.78,92.2 41.78,87.25 41.4,86.87 JAS5.1 | RS10.2 50.89,92.49 51.31,92.08 51.31,87.25 50.93,86.87 JAS4.1 | RS8.2 60.36,92.42 60.71,92.08 60.71,87.25 60.33,86.87 JAS3.1 | RS6.2 69.88,92.42 70.36,91.95 70.36,87.25 69.98,86.87 JAS2.1
  pour Top (isolate 0.254, rank 4, no thermals): 43.94,73.28 43.94,69.85 44.2,69.6 48.01,69.6 50.55,72.14 50.55,82.93 50.93,83.31 80.01,83.31 80.01,90.68 10.41,90.68 10.03,90.17 10.03,83.95 10.54,83.31 44.32,83.31 44.7,82.93 44.7,74.04
+VP2
  Top 0.406: R11.2 83.44,71.75 83.31,71.88 83.31,74.66 SENSE_VP2.4
  pour Top (isolate 0.254, rank 2, no thermals): 83.95,70.23 90.68,70.23 91.06,70.61 91.06,80.26 91.57,80.77 99.69,80.77 99.95,81.03 99.95,90.42 99.57,90.81 80.64,90.81 80.64,83.31 85.09,83.31 85.34,83.06 85.34,73.41 85.09,73.15 84.07,73.15 83.95,73.03
+VP3  (via drill 0.3 pad 0.61)
  Top 0.406: R14.2 123.44,71.75 123.19,72.01 123.19,74.66 SENSE_VP3.4
  other vias: 127.13,73.03 126.24,73.03 126.24,72.14 127.13,72.14 127.13,71.25 126.24,71.25 126.24,70.36 127.13,70.36 107.57,50.67 108.71,50.67 106.3,50.67 105.03,50.67 105.03,49.66 106.3,49.66 107.57,49.66 108.71,49.66
  pour Top (isolate 0.254, rank 4, no thermals): 124.59,70.23 127.38,70.23 127.51,70.36 127.51,73.15 127.38,73.28 124.71,73.28 124.71,70.36
  pour Bottom (isolate 0.254, rank 4, no thermals): 125.86,73.41 129.79,73.41 130.05,73.15 130.05,57.02 129.67,56.64 109.73,56.64 109.22,56.13 109.22,49.66 108.84,49.28 104.9,49.28 104.52,49.66 104.52,59.82 105.41,60.71 125.09,60.71 125.86,61.47
  pour Top (isolate 0.254, rank 4, no thermals): 104.52,37.59 104.52,50.93 104.78,51.18 169.29,51.18 169.54,50.93 169.54,37.34 169.16,36.96 165.61,36.96 165.23,37.34 165.23,47.5 108.71,47.5 108.2,46.99 108.2,37.59 107.82,37.21 104.9,37.21
  pour Top (isolate 0.254, rank 4, no thermals): 125.22,37.08 127.89,37.08 128.27,37.47 128.27,48.01 124.84,48.01 124.84,37.47
  pour Top (isolate 0.254, rank 4, no thermals): 145.54,37.08 148.21,37.08 148.59,37.47 148.59,48.01 145.16,48.01 145.16,37.47
+VP4  (via drill 0.3 pad 0.61)
  Top 0.254: v195.45,38.73 195.58,37.85 | v195.45,49.53 195.2,49.53 | v195.45,82.42 195.33,82.42 | v195.45,60.96 195.07,60.96 | v195.45,71.63 195.07,71.63 | v195.45,93.98 194.82,93.98
  Top 0.406: R16.2 163.19,71.63 162.94,71.88 162.94,74.82 SENSE_VP4.4
  Bottom 0.254: D2.C 185.29,47.24 v185.67,46.86 | D1.C 185.17,36.45 v185.67,36.96 | D3.C 185.17,58.67 v185.55,58.29 | D4.C 185.42,69.47 v185.67,69.22 | D5.C 185.17,80.26 v185.55,79.88 | D6.C 185.17,91.06 v185.55,90.68 | R45.2 v195.45,49.53 | R37.2 v195.45,38.73 | R54.2 v195.45,82.42 | R48.2 v195.45,60.96 | R51.2 v195.45,71.63 | R57.2 v195.45,93.98
  Bottom 0.813: C13.1 184.15,37.07 D1.C | C35.1 184.15,47.86 D2.C | C45.1 184.15,91.68 D6.C | C43.1 184.02,81.01 D5.C | C39.1 184.15,70.09 D4.C
  Bottom 1.016: C37.1 184.15,59.29 D3.C
  other vias: 185.67,35.94 185.67,34.92 185.55,89.66 185.55,91.69 185.55,78.87 185.55,80.9 185.67,68.2 185.67,70.23 185.55,57.28 185.55,59.31 185.67,45.85 185.67,47.88
  pour Top (isolate 0.254, no thermals): 104.39,81.41 104.39,78.61 104.52,78.49 163.7,78.49 164.08,78.11 164.08,70.36 164.34,70.1 168.28,70.1 168.28,80.9 167.77,81.41
  pour Top (isolate 0.254, no thermals): 104.78,82.17 104.78,81.03 107.31,81.03 107.31,81.28 106.93,81.66 106.93,82.17
  pour Top (isolate 0.254, no thermals): 112.39,82.04 112.39,80.9 114.94,80.9 114.94,81.15 114.55,81.53 114.55,82.04
  pour Top (isolate 0.254, no thermals): 120.02,82.04 120.02,80.9 122.56,80.9 122.56,81.15 122.17,81.53 122.17,82.04
  pour Top (isolate 0.254, no thermals): 127.76,82.04 127.76,80.9 130.3,80.9 130.3,81.15 129.92,81.53 129.92,82.04
  pour Top (isolate 0.254, no thermals): 135.38,82.04 135.38,80.9 137.92,80.9 137.92,81.15 137.54,81.53 137.54,82.04
  pour Top (isolate 0.254, no thermals): 143,82.04 143,80.9 145.54,80.9 145.54,81.15 145.16,81.53 145.16,82.04
  pour Top (isolate 0.254, no thermals): 150.75,82.04 150.75,80.9 153.29,80.9 153.29,81.15 152.91,81.53 152.91,82.04
  pour Top (isolate 0.254, no thermals): 158.5,82.17 158.5,81.03 161.04,81.03 161.04,81.28 160.66,81.66 160.66,82.17
  pour Top (isolate 0.254, rank 4, no thermals): 167.64,70.1 177.29,70.1 177.67,69.72 177.67,67.56 178.44,66.8 191.9,66.8 192.02,34.29 195.96,34.29 196.34,34.67 196.47,95.5 194.82,97.16 191.9,97.16 191.52,80.9 191.77,69.34 187.58,69.34 186.31,70.61 186.31,72.01 186.18,72.14 183.13,72.14 180.47,74.68 167.51,74.68 167.51,70.23
  pour Top (isolate 0.254, rank 2, no thermals): 192.02,34.29 185.17,34.29 185.04,34.42 185.04,37.47 186.44,37.47 187.58,36.32 192.02,36.32
  pour Top (isolate 0.254, rank 2, no thermals): 192.02,45.09 185.29,45.09 185.17,45.21 185.17,48.26 186.56,48.26 187.71,47.12 192.02,47.12
  pour Top (isolate 0.254, rank 2, no thermals): 192.02,56.52 185.29,56.52 185.17,56.64 185.17,59.69 186.56,59.69 187.71,58.55 192.02,58.55
  pour Top (isolate 0.254, rank 2, no thermals): 191.64,78.11 185.17,78.11 185.04,78.23 185.04,81.28 186.44,81.28 187.58,80.14 191.64,80.14
  pour Top (isolate 0.254, rank 4, no thermals): 191.9,88.9 185.29,88.9 185.17,89.03 185.17,92.08 186.56,92.08 187.71,90.93 191.9,90.93
  pour Top (isolate 0.254, rank 2, no thermals): 189.23,41.15 191.9,41.15 192.28,41.53 192.28,42.16 189.23,42.16
  pour Top (isolate 0.254, rank 2, no thermals): 189.23,51.94 191.9,51.94 192.28,52.32 192.28,52.96 189.23,52.96
  pour Top (isolate 0.254, rank 2, no thermals): 189.23,63.37 191.9,63.37 192.28,63.75 192.28,64.39 189.23,64.39
  pour Top (isolate 0.254, rank 2, no thermals): 189.23,74.17 191.9,74.17 192.28,74.55 192.28,75.18 189.23,75.18
  pour Top (isolate 0.254, rank 2, no thermals): 189.23,84.96 191.9,84.96 192.28,85.34 192.28,85.98 189.23,85.98
  pour Top (isolate 0.254, rank 2, no thermals): 189.23,95.5 191.9,95.5 192.28,95.89 192.28,96.52 189.23,96.52
ADC1_EOC  (via drill 0.3 pad 0.61)
  Route15 0.254: v26.29,50.04 26.29,38.73 26.67,38.35 v28.7,38.35
  Bottom 0.254: ADC1.19 v28.7,38.35 | JCTRL.9 28.71,55 26.29,52.58 v26.29,50.04
ADC1_VBAT  (via drill 0.3 pad 0.61)
  Route2 0.254: v58.42,45.09 56.01,42.67 56.01,35.43 55.63,35.05 v47.5,35.05
  Bottom 0.254: ADC1.5 42.16,34.54 42.42,34.29 44.07,34.29 44.83,35.05 v47.5,35.05 | R92.2 60.24,51.21 | 60.24,51.21 C65.1 | 60.24,51.21 60.24,51.09 59.18,50.04 59.18,45.85 v58.42,45.09
ADC1_VP1
  Bottom 0.254: R86.2 26.29,39.65 26.29,40.39 26.67,40.77 36.58,40.77 36.96,40.39 36.96,37.59 37.47,37.08 ADC1.3
  Bottom 0.406: R86.2 26.24,38.15 C61.1
ADC1_VP2
  Bottom 0.254: C62.1 26.29,34.54 27.18,34.54 27.56,34.92 27.56,40.01 27.81,40.26 35.94,40.26 36.32,39.88 36.32,36.58 37.08,35.81 ADC1.4
  Bottom 0.406: R87.2 26.24,34.56 C62.1
ADC1_VP3
  Bottom 0.254: ADC1.1 39.37,41.4 38.99,41.78 11.94,41.78 11.68,41.53 11.68,35.05 11.94,34.8 12.82,34.8 C63.1
  Bottom 0.406: R88.2 12.87,34.75 C63.1
ADC1_VP4
  Bottom 0.254: R89.2 12.87,40.94 13.21,41.27 37.34,41.27 37.72,40.89 37.72,38.73 38.1,38.35 ADC1.2
  Bottom 0.406: C64.1 R89.2
ADC1_VREF
  Bottom 0.254: 28.07,31.24 28.07,31.11 C59.1
  Bottom 0.406: ADC1.14 28.83,32 28.07,31.24 26.39,31.24 REF1.2
ADC2_EOC  (via drill 0.3 pad 0.61)
  Route2 0.254: v150.37,38.86 150.37,41.4 151.38,42.42 151.38,46.99 v151.13,47.24
  Route15 0.254: v151.13,47.24 149.86,48.51 145.54,48.51 141.99,52.07 116.33,52.07 112.01,56.39 91.69,56.39 90.42,55.12 69.85,55.12 67.31,57.66 50.55,57.66 50.29,57.91 50.29,62.23 50.04,62.48 27.18,62.48 26.92,62.23 v26.92,50.67
  Bottom 0.254: ADC2.19 139.45,48.77 138.18,47.5 138.18,43.69 138.94,42.93 142.49,42.93 143,42.42 149.86,42.42 150.11,42.16 150.11,39.12 v150.37,38.86 | JCTRL.10 29.21,54.73 26.92,52.45 v26.92,50.67
ADC2_MOTA1  (via drill 0.3 pad 0.61)
  Route15 0.254: v131.19,62.99 v81.15,62.99
  Bottom 0.254: ADC2.9 148.34,63.12 148.08,63.37 134.49,63.37 134.11,62.99 v131.19,62.99 | C66.1 59.18,57.76 R99.2 59.18,62.61 59.56,62.99 v81.15,62.99
ADC2_MOTA2  (via drill 0.3 pad 0.61)
  Route15 0.254: v131.7,62.36 v81.66,62.36
  Bottom 0.254: ADC2.8 147.07,62.61 146.81,62.87 135,62.87 134.49,62.36 v131.7,62.36 | C67.1 R100.2 75.44,58.97 75.44,62.1 75.69,62.36 v81.66,62.36
ADC2_MOTA3  (via drill 0.3 pad 0.61)
  Route15 0.254: v131.19,61.72 v81.15,61.72
  Bottom 0.254: ADC2.7 145.8,62.1 145.54,62.36 135.25,62.36 134.62,61.72 v131.19,61.72 | R101.2 75.27,52.67 C68.1 75.26,54.82 75.56,55.12 80.9,55.12 81.15,55.37 v81.15,61.72
ADC2_MOTB1
  Bottom 0.254: ADC2.4 141.99,61.59 141.73,61.85 135.64,61.85 134.87,61.09 131.83,61.09 130.81,60.07 130.81,53.85 130.18,53.21 112.01,53.21 111.63,52.83 111.63,46.48 111.89,46.23 114.55,46.23 114.77,46.01 C74.1 R102.2
ADC2_MOTB2
  Bottom 0.254: ADC2.3 140.72,61.09 140.46,61.34 135.89,61.34 135.13,60.58 132.08,60.58 131.32,59.82 131.32,53.59 130.43,52.7 115.32,52.7 115.06,52.45 115.06,51.72 R109.2 115.03,50.36 C75.1
ADC2_MOTB3
  Bottom 0.254: ADC2.2 139.45,56.39 139.19,56.13 135,56.13 134.62,55.75 134.62,47.88 134.24,47.5 131.57,47.5 131.19,47.12 131.19,45.24 C77.1 131.17,43.89 R111.2
ADC2_MOTB4
  Bottom 0.254: ADC2.1 138.18,57.02 137.79,56.64 132.33,56.64 131.95,56.26 131.95,52.43 R110.2 131.22,50.3 C76.1
ADC2_MOTB5
  Bottom 0.254: ADC2.11 151.38,50.29 153.54,48.13 155.07,48.13 155.57,47.62 155.57,45.7 C78.1 155.56,44.46 R112.2
ADC2_MOTB6
  Bottom 0.254: ADC2.12 148.34,52.2 148.72,52.58 155.22,52.58 R119.2 155.51,51.1 C79.1
ADC2_MOTB7
  Bottom 0.254: ADC2.6 144.53,58.42 144.78,58.17 151.26,58.17 151.76,57.66 151.76,54.36 152.02,54.1 174.37,54.1 174.88,53.59 174.88,47.24 174.62,46.99 171.7,46.99 171.58,46.86 171.58,45.9 C81.1 171.64,45.84 R121.2
ADC2_MOTB8
  Bottom 0.254: ADC2.5 143.26,58.04 143.64,57.66 151,57.66 151.26,57.4 151.26,53.72 151.51,53.47 171.32,53.47 171.58,53.21 171.58,52.17 R120.2 171.64,50.88 C80.1
ADC2_VREF
  Bottom 0.254: ADC2.14 145.8,48.19 C69.1 147.46,48.17 REF2.2
ASV1_OUT
  Bottom 0.406: ASV1.4 76.71,89.57 | 76.71,89.57 75.6,89.57 75.18,89.15 JAS1.2 | RS4.1 76.58,89.7 76.71,89.57
ASV1_PWM  (via drill 0.3 pad 0.61)  (1 unrouted)
  Route2 0.254: v44.58,61.09 44.58,59.82 44.45,59.69 35.31,59.69 34.8,60.2 34.8,83.57 35.05,83.82 70.87,83.82 71.12,84.07 71.12,92.96 v71.37,93.22
  Bottom 0.254: 44.71,60.96 v44.58,61.09 | v71.37,93.22 71.37,92.67 RS3.1
ASV2_OUT
  Bottom 0.406: ASV2.4 67.18,89.63 | 67.18,89.63 66.01,89.63 65.66,89.28 JAS2.2 | RS6.1 67.3,89.75 67.18,89.63
ASV2_PWM  (via drill 0.3 pad 0.61)  (1 unrouted)
  Route2 0.254: v45.34,61.59 45.34,59.31 45.21,59.18 35.05,59.18 34.29,59.94 34.29,84.07 34.54,84.33 61.21,84.33 61.47,84.58 61.47,92.71 v61.72,92.96
  Bottom 0.254: 45.21,60.7 45.34,60.83 v45.34,61.59 | v61.72,92.96 61.94,92.96 RS5.1
ASV3_OUT
  Bottom 0.406: ASV3.4 57.78,89.63 | 57.78,89.63 56.61,89.63 56.13,89.15 JAS3.2 | RS8.1 57.65,89.76 57.78,89.63
ASV3_PWM  (via drill 0.3 pad 0.61)  (1 unrouted)
  Route2 0.254: v46.1,61.09 46.1,58.8 45.97,58.67 34.8,58.67 33.78,59.69 33.78,84.58 34.04,84.84 51.82,84.84 52.07,85.09 52.07,92.96 v52.32,93.22
  Bottom 0.254: 45.71,60.44 46.1,60.83 v46.1,61.09 | v52.32,93.22 52.32,92.92 RS7.1
ASV4_OUT
  Bottom 0.406: ASV4.4 48.26,89.63 | 48.26,89.63 47.08,89.63 46.74,89.28 JAS4.2 | RS10.1 48.38,89.75 48.26,89.63
ASV4_PWM  (via drill 0.3 pad 0.61)  (1 unrouted)
  Route2 0.254: v46.74,61.72 46.74,58.42 46.48,58.17 34.54,58.17 33.27,59.44 33.27,85.09 33.53,85.34 42.42,85.34 42.67,85.6 42.67,92.96 v42.93,93.22
  Bottom 0.254: 46.21,60.18 46.74,60.71 v46.74,61.72 | v42.93,93.22 42.93,92.92 RS9.1
ASV5_OUT
  Bottom 0.406: ASV5.4 38.73,89.63 | 38.73,89.63 37.56,89.63 37.21,89.28 JAS5.2 | RS12.1 38.86,89.75 38.73,89.63
ASV5_PWM  (via drill 0.3 pad 0.61)  (1 unrouted)
  Route2 0.254: v47.37,61.09 47.37,57.78 47.24,57.66 34.29,57.66 32.77,59.18 32.77,92.71 v33.27,93.22
  Bottom 0.254: 46.71,59.91 47.37,60.58 v47.37,61.09 | v33.27,93.22 33.27,92.8 RS11.1
ASV6_OUT
  Bottom 0.406: ASV6.4 29.46,89.63 | 29.46,89.63 28.16,89.63 27.81,89.28 JAS6.2 | RS14.1 29.59,89.75 29.46,89.63
ASV6_PWM  (via drill 0.3 pad 0.61)  (1 unrouted)
  Route2 0.254: v48.13,61.72 48.13,57.28 48.01,57.15 34.04,57.15 32.26,58.93 32.26,92.2 32,92.46 24.64,92.46 v23.88,93.22
  Bottom 0.254: 47.21,59.65 48.13,60.58 v48.13,61.72 | v23.88,93.22 23.88,93.18 RS13.1
ASV7_OUT
  Bottom 0.406: ASV7.4 19.81,89.63 | 19.81,89.63 18.64,89.63 18.29,89.28 JAS7.2 | RS16.1 19.81,89.63
ASV7_PWM  (via drill 0.3 pad 0.61)  (1 unrouted)
  Route2 0.254: v48.77,61.09 48.77,56.9 48.51,56.64 33.78,56.64 31.75,58.67 31.75,85.09 31.5,85.34 14.48,85.34 14.22,85.6 14.22,92.96 v14.48,93.22
  Bottom 0.254: 47.71,59.39 48.77,60.45 v48.77,61.09 | v14.48,93.22 14.48,92.54 RS15.1
ASV8_OUT
  Bottom 0.406: ASV8.4 10.54,89.63 | 10.54,89.63 9.11,89.63 8.76,89.28 JAS8.2 | RS18.1 10.54,89.63
ASV8_PWM  (via drill 0.3 pad 0.61)  (1 unrouted)
  Route2 0.254: v49.4,61.72 49.4,56.26 49.28,56.13 33.53,56.13 31.24,58.42 31.24,84.58 30.99,84.84 5.08,84.84 4.83,85.09 4.83,92.96 v5.08,93.22
  Bottom 0.254: 48.21,59 49.4,60.2 v49.4,61.72 | v5.08,93.22 5.08,92.8 RS17.1
CEL1_MEAS
  Bottom 0.254: R78.2 33.4,6.48 C46.1 R79.2 35.01,6.35 38.23,6.35 38.61,6.73 38.61,8.76 41.66,11.81 41.66,33.02 41.4,33.27 ADC1.6
CEL2_MEAS
  Bottom 0.254: R59.2 33.4,10.16 C48.1 R60.2 34.96,10.16 38.61,10.16 41.02,12.57 41.02,31.62 40.64,32 ADC1.7
CEL3_MEAS
  Bottom 0.254: R62.2 33.4,13.97 C50.1 R63.2 34.96,13.97 37.47,13.97 37.85,14.35 37.85,29.21 38.1,29.46 ADC1.9
CEL4_MEAS
  Bottom 0.254: R65.2 33.4,17.78 C52.1 R66.2 34.96,17.78 36.7,17.78 37.08,18.16 37.08,30.23 37.59,30.73 ADC1.8
CEL5_MEAS
  Bottom 0.254: R68.2 33.4,21.59 C54.1 R69.2 34.96,21.59 35.81,21.59 35.94,21.72 35.94,29.21 35.69,29.46 ADC1.12
CEL6_MEAS
  Bottom 0.254: R71.2 33.4,25.4 C56.1 R72.2 34.92,27.94 34.67,28.19 ADC1.11
DSV1_TXRX  (via drill 0.3 pad 0.61)
  Route2 0.254: v43.81,61.59 43.81,60.33 43.69,60.2 35.56,60.2 35.31,60.45 35.31,83.06 35.56,83.31 84.58,83.31 | 84.58,83.31 93.98,83.31 94.23,83.57 JDSV1.2 | JDSV2.2 84.71,83.44 84.58,83.31
  Bottom 0.254: JCTRL.40 44.21,60.44 43.81,60.83 v43.81,61.59
GND  (via drill 0.3 pad 0.61)  (238 unrouted)
  other vias: 171.07,49.15 171.07,47.88 157.73,84.33 149.99,84.33 142.24,84.33 134.62,84.33 127,84.33 119.25,84.33 111.63,84.33
  pour Bottom (isolate 0.254, rank 6, no thermals): 0,100 200,100 200,0 0,0
  pour Top (isolate 0.254, rank 6, no thermals): 0,100 200,100 200,0 0,0
IOE_!RESET!  (via drill 0.3 pad 0.61)
  Route2 0.254: v21.08,50.04 21.08,61.98 v24.38,65.28
  Route15 0.254: 104.65,67.06 82.8,67.06 80.01,69.85 v74.3,69.85 72.14,69.85 71.37,70.61 50.29,70.61 46.74,67.06 28.7,67.06 28.19,66.55 24.64,66.55 24.38,66.29 v24.38,65.28 | 104.65,67.06 v104.65,67.82 | 104.65,67.06 105.66,67.06 106.93,68.33 130.05,68.33 130.81,67.56 138.68,67.56 139.7,66.55 146.3,66.55 v147.07,67.31
  Bottom 0.254: JCTRL.1 24.71,57.09 21.08,53.47 v21.08,50.04 | IOE1.18 v74.3,69.85 | v104.65,67.82 IOE3.18 | v147.07,67.31 148.21,67.31 148.46,67.56 IOE2.18
MOS1_EN  (via drill 0.3, 0.3 pad 0.61)
  Top 0.203: MOS1.5 v161.42,81.41
  Route15 0.254: v100.84,74.42 100.84,74.68 101.35,75.18 108.71,75.18 109.73,76.2 112.01,76.2 v113.79,77.98
  Bottom 0.254: v161.42,81.41 155.57,81.41 153.92,79.76 134.62,79.76 134.11,79.25 124.71,79.25 124.21,78.74 118.36,78.74 117.6,77.98 v113.79,77.98 | IOE3.8 v100.84,74.42
MOS1_OUT
  Bottom 0.305: C40.2 160.02,86.11 160.4,86.49 JM1.1
  pour Top (isolate 0.254, no thermals): 157.61,85.09 161.67,85.09 161.67,86.23 161.93,86.49 161.93,89.15 161.8,89.28 159.64,89.28 159.51,89.15 159.51,86.74 159.26,86.49 157.61,86.49
MOS2_EN  (via drill 0.3, 0.3 pad 0.61)
  Top 0.203: MOS2.5 v153.54,81.41
  Route15 0.254: v99.57,74.93 99.82,74.93 100.58,75.69 108.46,75.69 109.47,76.71 111.25,76.71 v112.52,77.98
  Bottom 0.254: v153.54,81.41 147.19,81.41 146.05,80.26 134.37,80.26 133.86,79.76 124.46,79.76 123.95,79.25 118.11,79.25 117.6,78.74 113.28,78.74 v112.52,77.98 | IOE3.7 v99.57,74.93
MOS2_OUT
  Bottom 0.305: C6.2 152.71,88.21 JM2.1
  pour Top (isolate 0.254, no thermals): 149.86,85.09 153.8,85.09 153.8,86.36 154.18,86.74 154.18,89.15 154.05,89.28 151.89,89.28 151.76,89.15 151.76,86.74 151.51,86.49 149.86,86.49
MOS3_EN  (via drill 0.3, 0.3 pad 0.61)
  Top 0.203: MOS3.5 v145.8,81.41
  Route15 0.254: v98.3,75.95 99.82,75.95 100.08,76.2 108.2,76.2 109.22,77.22 110.49,77.22 v111.25,77.98
  Bottom 0.254: v145.8,81.41 140.59,81.41 139.95,80.77 134.11,80.77 133.6,80.26 124.21,80.26 123.7,79.76 117.86,79.76 117.35,79.25 112.52,79.25 v111.25,77.98 | IOE3.6 v98.3,75.95
MOS3_OUT
  Bottom 0.305: C8.2 145.11,88.34 JM3.1
  pour Top (isolate 0.254, no thermals): 142.37,85.09 146.05,85.09 146.05,86.36 146.56,86.87 146.56,89.15 146.43,89.28 144.4,89.28 144.27,89.15 144.27,86.74 144.02,86.49 142.37,86.49
MOS4_EN  (via drill 0.3, 0.3 pad 0.61)
  Top 0.203: MOS4.5 v138.18,81.41
  Route15 0.254: v97.03,76.71 107.95,76.71 109.22,77.98 v109.98,77.98
  Bottom 0.254: v138.18,81.41 138.05,81.28 133.86,81.28 133.35,80.77 123.95,80.77 123.44,80.26 117.6,80.26 117.09,79.76 111.76,79.76 v109.98,77.98 | IOE3.5 v97.03,76.71
MOS4_OUT
  Bottom 0.305: C10.2 137.62,88.32 JM4.1
  pour Top (isolate 0.254, no thermals): 134.49,85.09 138.43,85.09 138.43,86.23 139.06,86.87 139.06,89.15 138.94,89.28 136.78,89.28 136.65,89.15 136.65,86.74 136.4,86.49 134.49,86.49
MOS5_EN  (via drill 0.3)
  Top 0.203: MOS5.5 v130.56,81.41
  Bottom 0.254: v130.56,81.41 123.83,81.41 123.19,80.77 117.35,80.77 116.84,80.26 109.73,80.26 109.22,79.76 96.01,79.76 95.76,79.5 IOE3.4
MOS5_OUT
  Bottom 0.305: C5.2 130,88.31 JM5.1
  pour Top (isolate 0.254, no thermals): 126.87,85.09 130.81,85.09 130.81,86.23 131.44,86.87 131.44,89.15 131.32,89.28 129.16,89.28 129.03,89.15 129.03,86.74 128.78,86.49 126.87,86.49
MOS6_EN  (via drill 0.3)
  Top 0.203: MOS6.5 v122.81,81.41
  Bottom 0.254: v122.81,81.41 117.22,81.41 116.59,80.77 109.22,80.77 108.71,80.26 94.74,80.26 94.49,80.01 IOE3.3
MOS6_OUT
  Top 0.305: MOS6.3 121.86,85.53 121.67,85.72 C29.1
  Bottom 0.305: C28.2 122.26,88.35 JM6.1
  pour Top (isolate 0.254, no thermals): 119.51,85.09 123.06,85.09 123.06,86.23 123.83,87 123.83,89.15 123.7,89.28 121.54,89.28 121.41,89.15 121.41,86.74 121.16,86.49 119.51,86.49
MOS7_EN  (via drill 0.3)
  Top 0.203: MOS7.5 v115.19,81.66
  Bottom 0.254: v115.19,81.66 109.09,81.66 108.2,80.77 93.47,80.77 93.22,80.52 IOE3.2
MOS7_OUT
  Top 0.305: MOS7.3 114.24,85.66 114.3,85.72 C31.1
  Bottom 0.305: C30.2 114.64,88.35 JM7.1
  pour Top (isolate 0.254, no thermals): 111.89,85.09 115.44,85.09 115.44,86.23 116.2,86.87 116.2,89.15 116.08,89.28 113.92,89.28 113.79,89.15 113.79,86.74 113.54,86.49 111.89,86.49
MOS8_EN  (via drill 0.3)
  Top 0.203: MOS8.5 v107.57,81.66
  Bottom 0.254: IOE3.1 91.95,80.77 92.58,81.41 107.44,81.41 107.57,81.53 v107.57,81.66
MOS8_OUT
  Top 0.305: MOS8.3 106.62,85.79 106.68,85.85 102.99,85.85 C33.1
  Bottom 0.305: C32.2 107.02,88.35 JM8.1
  pour Top (isolate 0.254, no thermals): 104.27,85.09 107.82,85.09 107.82,86.23 108.58,86.87 108.58,89.15 108.46,89.28 106.3,89.28 106.17,89.15 106.17,86.74 105.92,86.49 104.27,86.49
MOT_!RESET!  (via drill 0.3 pad 0.61)
  Route2 0.254: v183.39,11.18 183.39,26.16 MOTB7-8.13 | MOTB5-6.13 162.31,27.94 162.56,27.69 v162.56,11.18 | MOTB3-4.13 141.99,27.94 142.24,27.69 v142.24,11.18 | MOTB1-2.13 121.67,27.94 121.92,27.69 v121.92,11.18 | MOTA3.13 100.08,27.94 100.33,27.69 v100.33,11.18 | MOTA2.13 79.76,27.94 80.01,27.69 v80.01,11.18 | v21.72,50.67 21.72,48.39 23.88,46.23 23.88,32.77 24.13,32.51 v33.53,32.51
  Route15 0.254: v33.53,32.51 38.61,32.51 38.86,32.26 38.86,29.46 39.12,29.21 54.86,29.21 55.12,28.96 55.12,27.94 | MOTA1.13 55.12,27.94 | 55.12,27.94 55.12,11.68 55.63,11.18 v80.01,11.18 v100.33,11.18 v121.92,11.18 v142.24,11.18 v162.56,11.18 v183.39,11.18
  Bottom 0.254: JCTRL.2 25.21,56.83 21.72,53.34 v21.72,50.67
MOTA1_!FAULT!  (via drill 0.3 pad 0.61)
  Route15 0.254: MOTA1.15 57.4,33.02 57.15,33.27 57.15,36.58 56.9,36.83 39.37,36.83 39.12,37.08 39.12,40.64 38.86,40.89 28.45,40.89 28.19,41.15 v28.19,50.67
  Bottom 0.254: JCTRL.12 30.21,54.21 28.19,52.2 v28.19,50.67
MOTA1_!SLEEP!  (via drill 0.3 pad 0.61)
  Route2 0.254: MOTA1.14 57.4,30.48 57.15,30.73 57.15,42.16 59.05,44.07 59.05,60.45 59.31,60.71 67.69,60.71 67.94,60.96 v67.94,68.07
  Bottom 0.254: v67.94,68.07 IOE1.23
MOTA1_DIR  (via drill 0.3 pad 0.61)
  Route15 0.254: v28.96,50.04 28.96,41.66 29.21,41.4 39.12,41.4 41.15,39.37 45.21,39.37 46.48,40.64 MOTA1.18
  Bottom 0.254: JCTRL.13 30.71,53.95 28.96,52.2 v28.96,50.04
MOTA1_PWM  (via drill 0.3 pad 0.61)
  Route15 0.254: v27.56,50.04 27.56,40.77 27.94,40.39 35.81,40.39 36.07,40.13 36.07,34.54 36.32,34.29 55.88,34.29 56.13,34.04 56.13,29.46 56.39,29.21 59.69,29.21 59.94,28.96 59.94,26.92 MOTA1.19
  Bottom 0.254: JCTRL.11 29.71,54.47 27.56,52.32 v27.56,50.04
MOTA1_SEN  (via drill 0.3 pad 0.61)
  Route2 0.254: MOTA1.16 59.69,35.56 59.82,35.69 59.82,59.44 60.07,59.69 v66.55,59.69
  Bottom 0.254: IC2.5 66.17,56.39 66.55,56.77 v66.55,59.69
MOTA2_!FAULT!  (via drill 0.3 pad 0.61)
  Route15 0.254: MOTA2.15 77.72,33.02 77.47,33.27 77.47,42.16 77.22,42.42 30.48,42.42 30.23,42.67 v30.23,50.04
  Bottom 0.254: JCTRL.15 31.71,53.42 30.23,51.94 v30.23,50.04
MOTA2_!SLEEP!  (via drill 0.3 pad 0.61)
  Route2 0.254: MOTA2.14 79.88,30.48 80.14,30.73 80.14,41.66 79.63,42.16 77.72,42.16 77.47,42.42 77.47,60.45 77.22,60.71 69.47,60.71 69.22,60.96 v69.22,68.07
  Bottom 0.254: v69.22,68.07 IOE1.22
MOTA2_DIR  (via drill 0.3 pad 0.61)
  Route15 0.254: MOTA2.18 78.74,42.67 78.49,42.93 30.99,42.93 30.86,43.05 v30.86,50.67
  Bottom 0.254: JCTRL.16 32.21,53.16 30.86,51.82 v30.86,50.67
MOTA2_PWM  (via drill 0.3 pad 0.61)
  Route15 0.254: MOTA2.19 77.22,25.4 76.96,25.65 76.96,41.66 76.71,41.91 29.72,41.91 29.59,42.04 v29.59,50.67
  Bottom 0.254: JCTRL.14 31.21,53.69 29.59,52.07 v29.59,50.67
MOTA2_SEN  (via drill 0.3 pad 0.61)
  Route2 0.254: MOTA2.16 77.6,35.56 77.34,35.81 77.34,41.78 76.96,42.16 76.96,59.94 76.71,60.2 70.61,60.2 v70.23,59.82
  Bottom 0.254: v70.23,59.82 68.45,59.82 68.2,59.56 68.2,56.64 68.45,56.39 IC2.10
MOTA3_!FAULT!  (via drill 0.3 pad 0.61)
  Route15 0.254: MOTA3.15 98.04,33.02 97.79,33.27 97.79,42.16 97.54,42.42 80.77,42.42 79.25,43.94 32.51,43.94 32.26,44.2 v32.26,50.67
  Bottom 0.254: JCTRL.18 33.21,52.64 32.26,51.69 v32.26,50.67
MOTA3_!SLEEP!  (via drill 0.3 pad 0.61)
  Route2 0.254: MOTA3.14 98.04,30.48 97.79,30.73 97.79,43.69 98.55,44.45 98.55,59.94 v99.31,60.71
  Route15 0.254: v99.31,60.71 70.74,60.71 70.48,60.96 v70.48,69.85
  Bottom 0.254: v70.48,69.85 IOE1.21
MOTA3_DIR  (via drill 0.3 pad 0.61)
  Route15 0.254: MOTA3.18 99.06,42.67 98.81,42.93 81.03,42.93 79.5,44.45 33.27,44.45 32.89,44.83 v32.89,50.04
  Bottom 0.254: JCTRL.19 33.71,52.38 32.89,51.56 v32.89,50.04
MOTA3_PWM  (via drill 0.3 pad 0.61)